# EAGLE design Modular-Sensor-Breakout-Board3 (EAGLE 5.12)

## Sheet 1 of 7
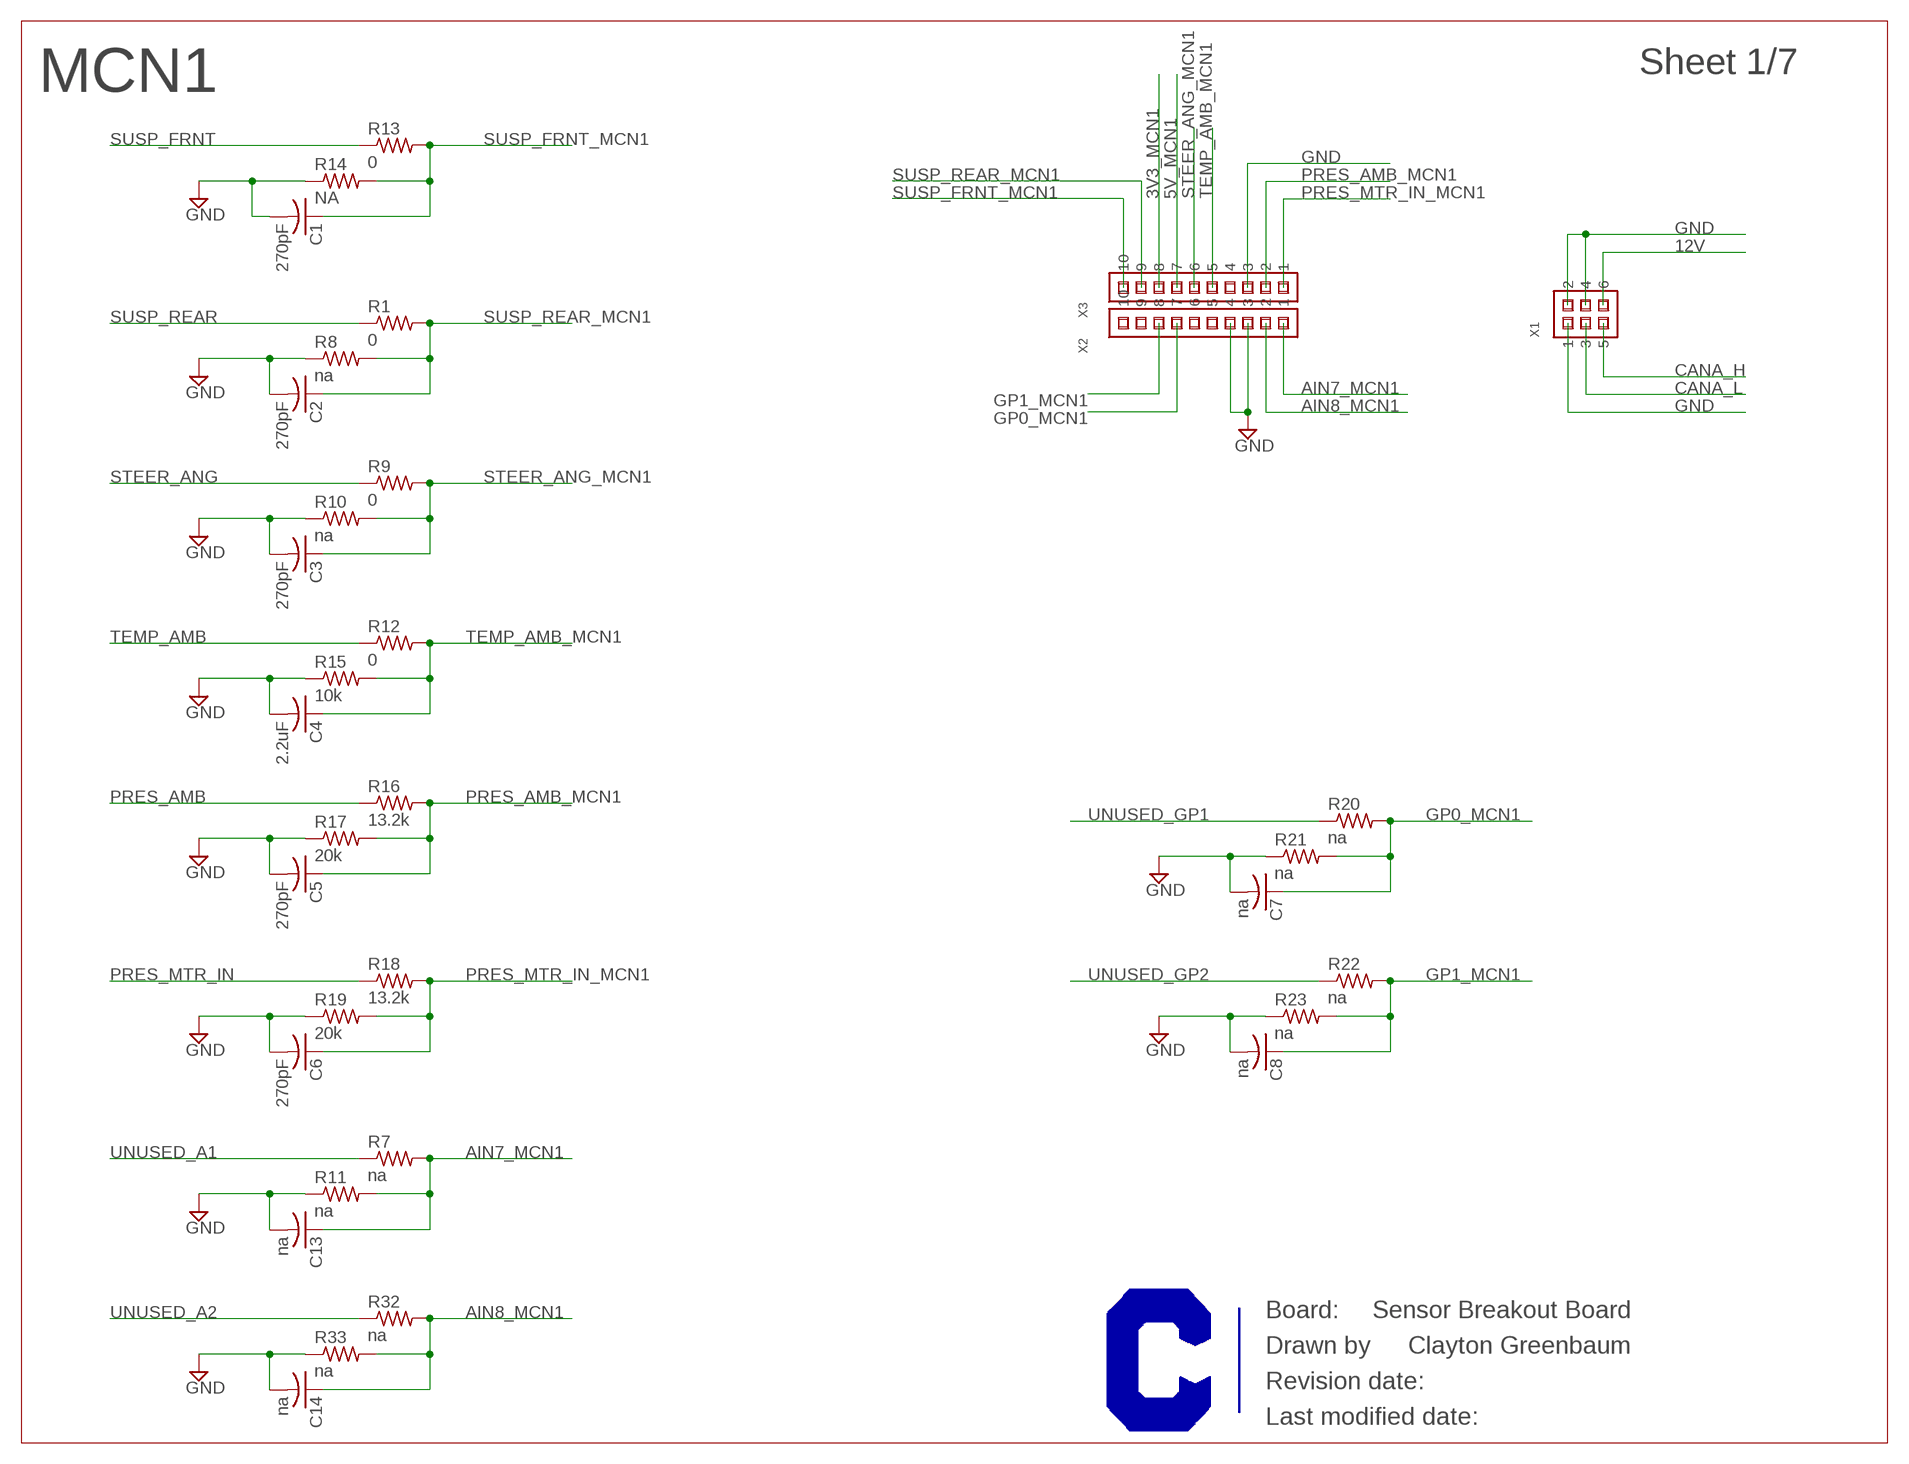
[diagram p0: schematic, sheet 1]

### Parts
C1  270pF  C-USC0603  [C0603]
C2  270pF  C-USC0603  [C0603]
C3  270pF  C-USC0603  [C0603]
C4  2.2uF  C-USC0603  [C0603]
C5  270pF  C-USC0603  [C0603]
C6  270pF  C-USC0603  [C0603]
C7  na  C-USC0603  [C0603]
C8  na  C-USC0603  [C0603]
C13  na  C-USC0603  [C0603]
C14  na  C-USC0603  [C0603]
R1  0  R-US_R0603  [R0603]
R7  na  R-US_R0603  [R0603]
R8  na  R-US_R0603  [R0603]
R9  0  R-US_R0603  [R0603]
R10  na  R-US_R0603  [R0603]
R11  na  R-US_R0603  [R0603]
R12  0  R-US_R0603  [R0603]
R13  0  R-US_R0603  [R0603]
R14  NA  R-US_R0603  [R0603]
R15  10k  R-US_R0603  [R0603]
R16  13.2k  R-US_R0603  [R0603]
R17  20k  R-US_R0603  [R0603]
R18  13.2k  R-US_R0603  [R0603]
R19  20k  R-US_R0603  [R0603]
R20  na  R-US_R0603  [R0603]
R21  na  R-US_R0603  [R0603]
R22  na  R-US_R0603  [R0603]
R23  na  R-US_R0603  [R0603]
R32  na  R-US_R0603  [R0603]
R33  na  R-US_R0603  [R0603]
X1  M22-71403XX  [M22-71403XX]
X2  M22-71310XX  [M22-71310XX]
X3  M22-71310XX  [M22-71310XX]

### Nets
3V3_MCN1: X3.8 ; also sheet 7
5V_MCN1: X3.7 ; also sheet 7
12V: X1.6 ; also sheet 2,3,4,5,6,7
AIN7_MCN1: C13.1 R7.2 R11.2 X2.1
AIN8_MCN1: C14.1 R32.2 R33.2 X2.2
CANA_H: X1.5 ; also sheet 2,3,5,6,7
CANA_L: X1.3 ; also sheet 2,3,5,6,7
GND: C1.2 C2.2 C3.2 C4.2 C5.2 C6.2 C7.2 C8.2 C13.2 C14.2 R8.1 R10.1 R11.1 R14.1 R15.1 R17.1 R19.1 R21.1 R23.1 R33.1 X1.1 X1.2 X1.4 X2.3 X2.4 X3.3 ; also sheet 2,3,4,5,6,7
GP0_MCN1: C7.1 R20.2 R21.2 X2.7
GP1_MCN1: C8.1 R22.2 R23.2 X2.8
PRES_AMB: R16.1 ; also sheet 7
PRES_AMB_MCN1: C5.1 R16.2 R17.2 X3.2
PRES_MTR_IN: R18.1 ; also sheet 7
PRES_MTR_IN_MCN1: C6.1 R18.2 R19.2 X3.1
STEER_ANG: R9.1 ; also sheet 7
STEER_ANG_MCN1: C3.1 R9.2 R10.2 X3.6
SUSP_FRNT: R13.1 ; also sheet 7
SUSP_FRNT_MCN1: C1.1 R13.2 R14.2 X3.10
SUSP_REAR: R1.1 ; also sheet 7
SUSP_REAR_MCN1: C2.1 R1.2 R8.2 X3.9
TEMP_AMB: R12.1 ; also sheet 7
TEMP_AMB_MCN1: C4.1 R12.2 R15.2 X3.5
UNUSED_A1: R7.1 ; also sheet 7
UNUSED_A2: R32.1 ; also sheet 7
UNUSED_GP1: R20.1 ; also sheet 7
UNUSED_GP2: R22.1 ; also sheet 7
Unconnected: X2.5 X2.6 X2.9 X2.10 X3.4

### Notes on the sheet
- MCN1
- Sensor Breakout Board
- Clayton Greenbaum

## Sheet 2 of 7
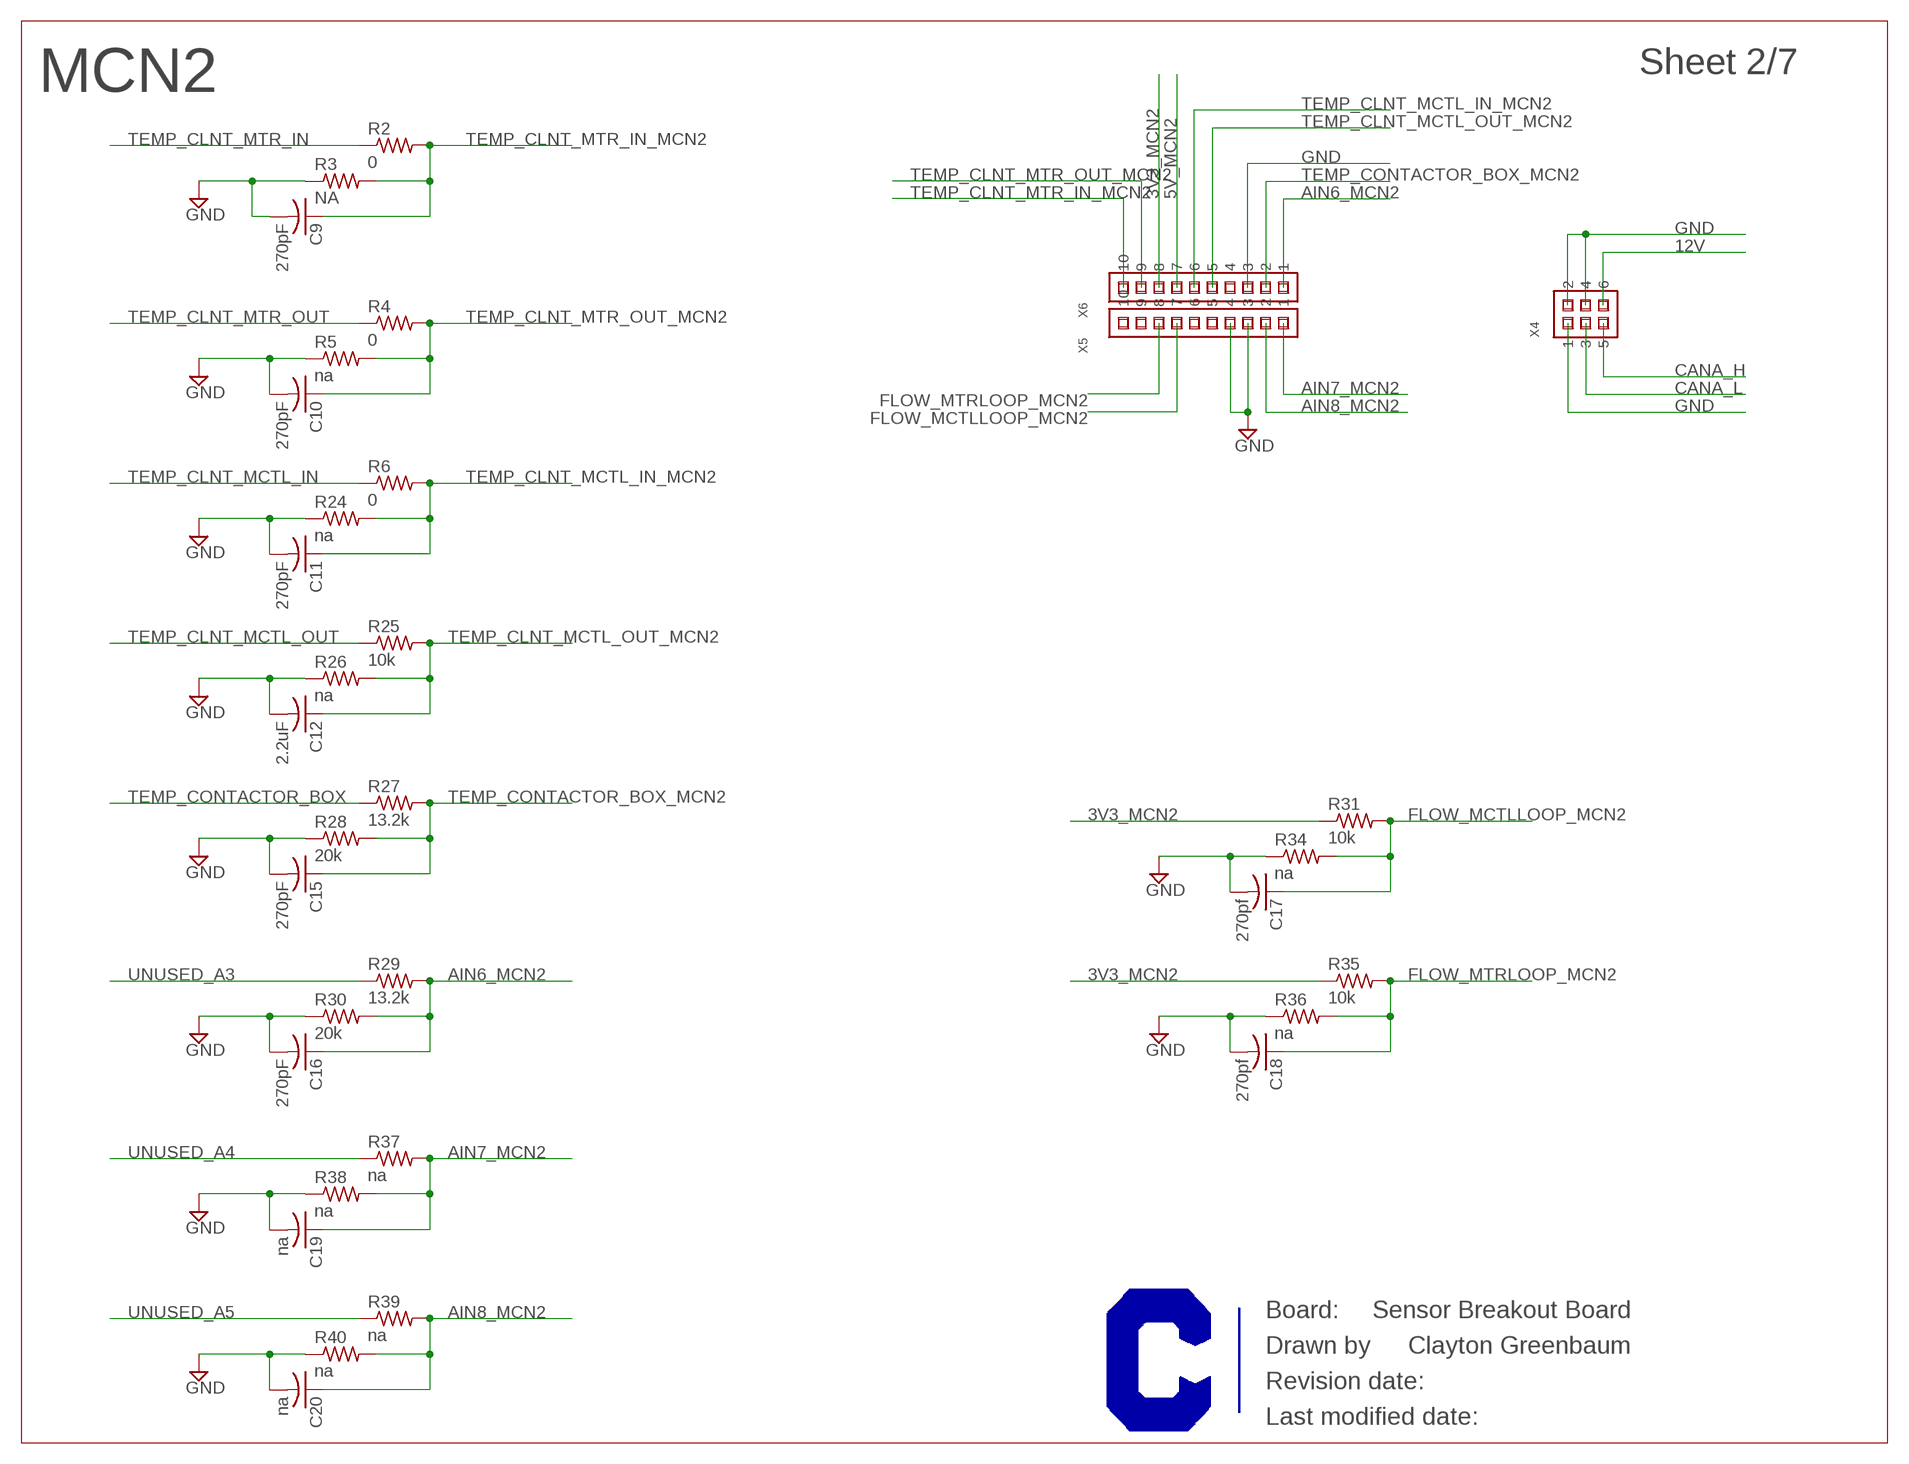
[diagram p1: schematic, sheet 2]

### Parts
C9  270pF  C-USC0603  [C0603]
C10  270pF  C-USC0603  [C0603]
C11  270pF  C-USC0603  [C0603]
C12  2.2uF  C-USC0603  [C0603]
C15  270pF  C-USC0603  [C0603]
C16  270pF  C-USC0603  [C0603]
C17  270pf  C-USC0603  [C0603]
C18  270pf  C-USC0603  [C0603]
C19  na  C-USC0603  [C0603]
C20  na  C-USC0603  [C0603]
R2  0  R-US_R0603  [R0603]
R3  NA  R-US_R0603  [R0603]
R4  0  R-US_R0603  [R0603]
R5  na  R-US_R0603  [R0603]
R6  0  R-US_R0603  [R0603]
R24  na  R-US_R0603  [R0603]
R25  10k  R-US_R0603  [R0603]
R26  na  R-US_R0603  [R0603]
R27  13.2k  R-US_R0603  [R0603]
R28  20k  R-US_R0603  [R0603]
R29  13.2k  R-US_R0603  [R0603]
R30  20k  R-US_R0603  [R0603]
R31  10k  R-US_R0603  [R0603]
R34  na  R-US_R0603  [R0603]
R35  10k  R-US_R0603  [R0603]
R36  na  R-US_R0603  [R0603]
R37  na  R-US_R0603  [R0603]
R38  na  R-US_R0603  [R0603]
R39  na  R-US_R0603  [R0603]
R40  na  R-US_R0603  [R0603]
X4  M22-71403XX  [M22-71403XX]
X5  M22-71310XX  [M22-71310XX]
X6  M22-71310XX  [M22-71310XX]

### Nets
3V3_MCN2: R31.1 R35.1 X6.8 ; also sheet 7
5V_MCN2: X6.7 ; also sheet 7
12V: X4.6 ; also sheet 1,3,4,5,6,7
AIN6_MCN2: C16.1 R29.2 R30.2 X6.1
AIN7_MCN2: C19.1 R37.2 R38.2 X5.1
AIN8_MCN2: C20.1 R39.2 R40.2 X5.2
CANA_H: X4.5 ; also sheet 1,3,5,6,7
CANA_L: X4.3 ; also sheet 1,3,5,6,7
FLOW_MCTLLOOP_MCN2: C17.1 R31.2 R34.2 X5.7 ; also sheet 7
FLOW_MTRLOOP_MCN2: C18.1 R35.2 R36.2 X5.8 ; also sheet 7
GND: C9.2 C10.2 C11.2 C12.2 C15.2 C16.2 C17.2 C18.2 C19.2 C20.2 R3.1 R5.1 R24.1 R26.1 R28.1 R30.1 R34.1 R36.1 R38.1 R40.1 X4.1 X4.2 X4.4 X5.3 X5.4 X6.3 ; also sheet 1,3,4,5,6,7
TEMP_CLNT_MCTL_IN: R6.1 ; also sheet 7
TEMP_CLNT_MCTL_IN_MCN2: C11.1 R6.2 R24.2 X6.6
TEMP_CLNT_MCTL_OUT: R25.1 ; also sheet 7
TEMP_CLNT_MCTL_OUT_MCN2: C12.1 R25.2 R26.2 X6.5
TEMP_CLNT_MTR_IN: R2.1 ; also sheet 7
TEMP_CLNT_MTR_IN_MCN2: C9.1 R2.2 R3.2 X6.10
TEMP_CLNT_MTR_OUT: R4.1 ; also sheet 7
TEMP_CLNT_MTR_OUT_MCN2: C10.1 R4.2 R5.2 X6.9
TEMP_CONTACTOR_BOX: R27.1 ; also sheet 7
TEMP_CONTACTOR_BOX_MCN2: C15.1 R27.2 R28.2 X6.2
UNUSED_A3: R29.1 ; also sheet 7
UNUSED_A4: R37.1 ; also sheet 7
UNUSED_A5: R39.1 ; also sheet 7
Unconnected: X5.5 X5.6 X5.9 X5.10 X6.4

### Notes on the sheet
- MCN2
- Sensor Breakout Board
- Clayton Greenbaum

## Sheet 3 of 7
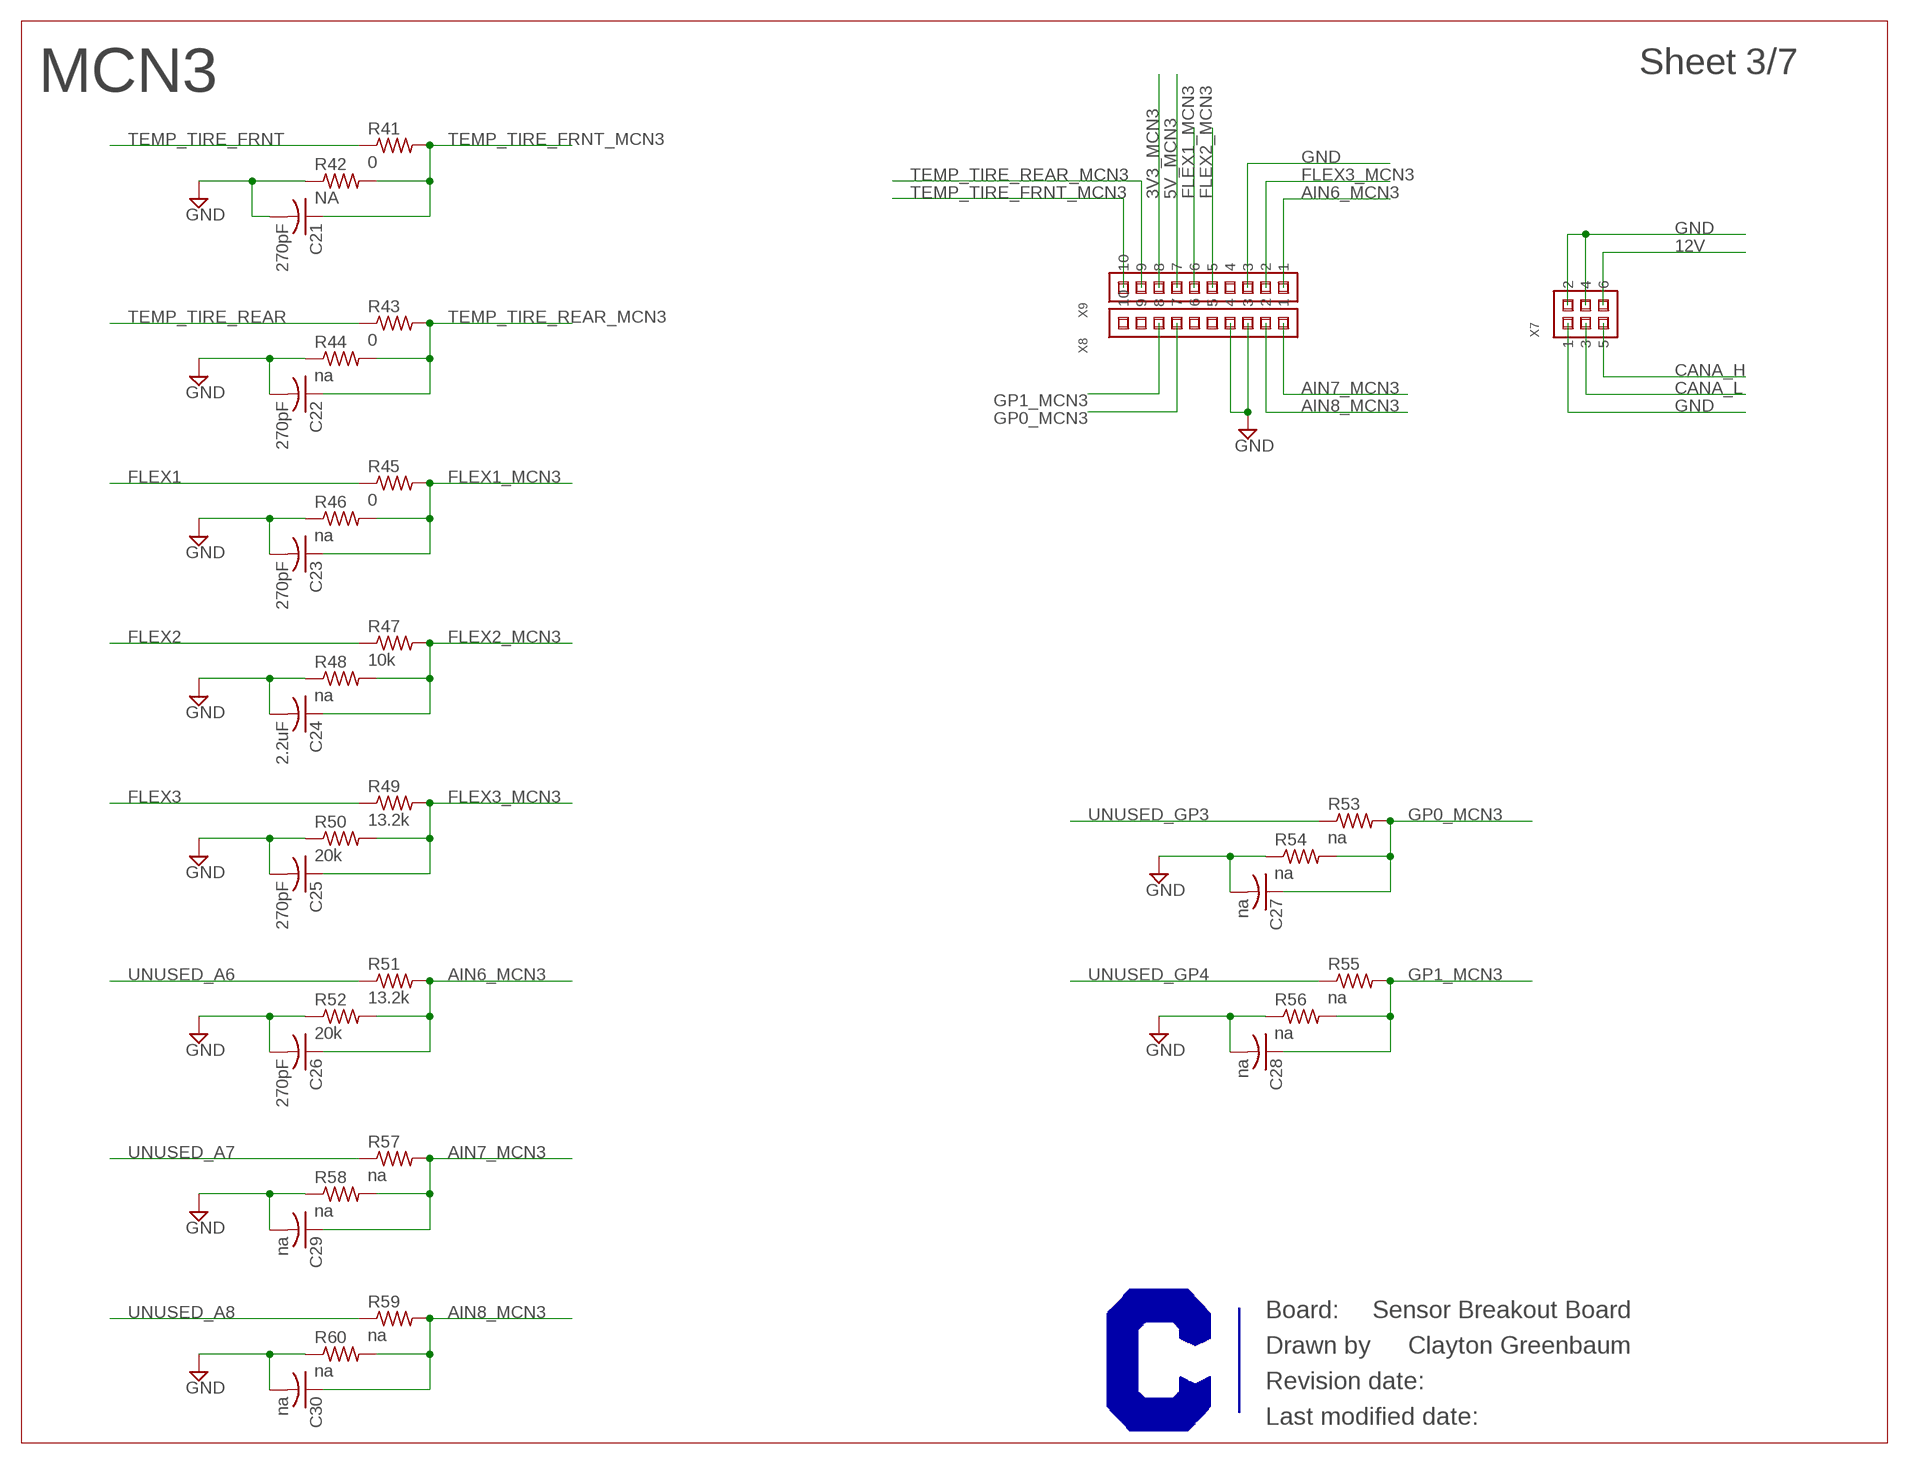
[diagram p2: schematic, sheet 3]

### Parts
C21  270pF  C-USC0603  [C0603]
C22  270pF  C-USC0603  [C0603]
C23  270pF  C-USC0603  [C0603]
C24  2.2uF  C-USC0603  [C0603]
C25  270pF  C-USC0603  [C0603]
C26  270pF  C-USC0603  [C0603]
C27  na  C-USC0603  [C0603]
C28  na  C-USC0603  [C0603]
C29  na  C-USC0603  [C0603]
C30  na  C-USC0603  [C0603]
R41  0  R-US_R0603  [R0603]
R42  NA  R-US_R0603  [R0603]
R43  0  R-US_R0603  [R0603]
R44  na  R-US_R0603  [R0603]
R45  0  R-US_R0603  [R0603]
R46  na  R-US_R0603  [R0603]
R47  10k  R-US_R0603  [R0603]
R48  na  R-US_R0603  [R0603]
R49  13.2k  R-US_R0603  [R0603]
R50  20k  R-US_R0603  [R0603]
R51  13.2k  R-US_R0603  [R0603]
R52  20k  R-US_R0603  [R0603]
R53  na  R-US_R0603  [R0603]
R54  na  R-US_R0603  [R0603]
R55  na  R-US_R0603  [R0603]
R56  na  R-US_R0603  [R0603]
R57  na  R-US_R0603  [R0603]
R58  na  R-US_R0603  [R0603]
R59  na  R-US_R0603  [R0603]
R60  na  R-US_R0603  [R0603]
X7  M22-71403XX  [M22-71403XX]
X8  M22-71310XX  [M22-71310XX]
X9  M22-71310XX  [M22-71310XX]

### Nets
3V3_MCN3: X9.8 ; also sheet 7
5V_MCN3: X9.7 ; also sheet 7
12V: X7.6 ; also sheet 1,2,4,5,6,7
AIN6_MCN3: C26.1 R51.2 R52.2 X9.1
AIN7_MCN3: C29.1 R57.2 R58.2 X8.1
AIN8_MCN3: C30.1 R59.2 R60.2 X8.2
CANA_H: X7.5 ; also sheet 1,2,5,6,7
CANA_L: X7.3 ; also sheet 1,2,5,6,7
FLEX1: R45.1 ; also sheet 7
FLEX1_MCN3: C23.1 R45.2 R46.2 X9.6
FLEX2: R47.1 ; also sheet 7
FLEX2_MCN3: C24.1 R47.2 R48.2 X9.5
FLEX3: R49.1 ; also sheet 7
FLEX3_MCN3: C25.1 R49.2 R50.2 X9.2
GND: C21.2 C22.2 C23.2 C24.2 C25.2 C26.2 C27.2 C28.2 C29.2 C30.2 R42.1 R44.1 R46.1 R48.1 R50.1 R52.1 R54.1 R56.1 R58.1 R60.1 X7.1 X7.2 X7.4 X8.3 X8.4 X9.3 ; also sheet 1,2,4,5,6,7
GP0_MCN3: C27.1 R53.2 R54.2 X8.7
GP1_MCN3: C28.1 R55.2 R56.2 X8.8
TEMP_TIRE_FRNT: R41.1 ; also sheet 7
TEMP_TIRE_FRNT_MCN3: C21.1 R41.2 R42.2 X9.10
TEMP_TIRE_REAR: R43.1 ; also sheet 7
TEMP_TIRE_REAR_MCN3: C22.1 R43.2 R44.2 X9.9
UNUSED_A6: R51.1 ; also sheet 7
UNUSED_A7: R57.1 ; also sheet 7
UNUSED_A8: R59.1 ; also sheet 7
UNUSED_GP3: R53.1 ; also sheet 7
UNUSED_GP4: R55.1 ; also sheet 7
Unconnected: X8.5 X8.6 X8.9 X8.10 X9.4

### Notes on the sheet
- MCN3
- Sensor Breakout Board
- Clayton Greenbaum

## Sheet 4 of 7
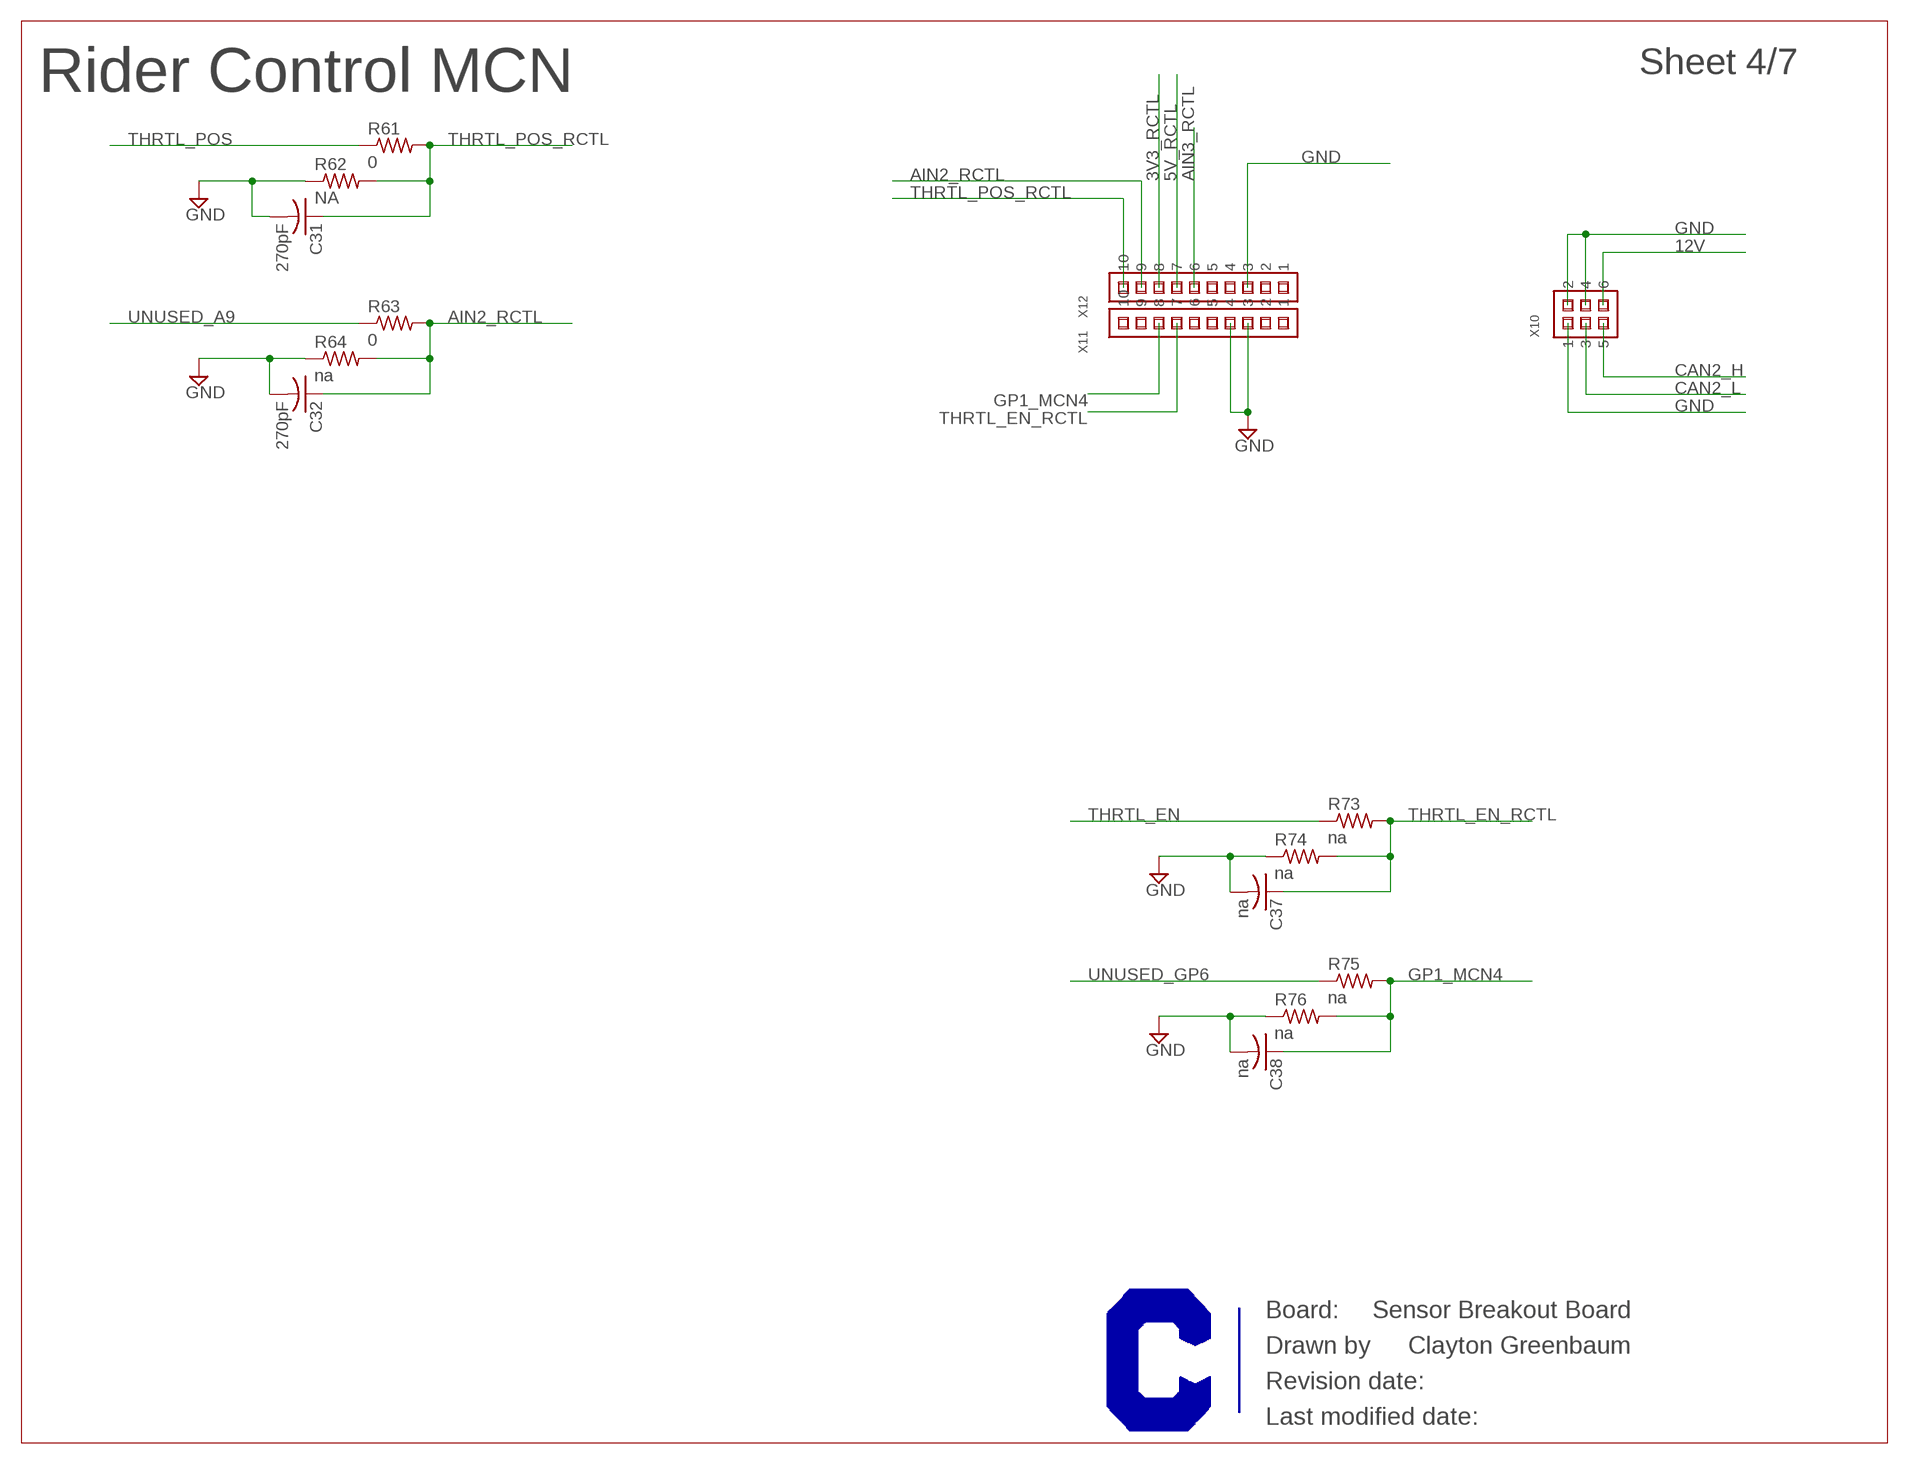
[diagram p3: schematic, sheet 4]

### Parts
C31  270pF  C-USC0603  [C0603]
C32  270pF  C-USC0603  [C0603]
C37  na  C-USC0603  [C0603]
C38  na  C-USC0603  [C0603]
R61  0  R-US_R0603  [R0603]
R62  NA  R-US_R0603  [R0603]
R63  0  R-US_R0603  [R0603]
R64  na  R-US_R0603  [R0603]
R73  na  R-US_R0603  [R0603]
R74  na  R-US_R0603  [R0603]
R75  na  R-US_R0603  [R0603]
R76  na  R-US_R0603  [R0603]
X10  M22-71403XX  [M22-71403XX]
X11  M22-71310XX  [M22-71310XX]
X12  M22-71310XX  [M22-71310XX]

### Nets
3V3_RCTL: X12.8 ; also sheet 7
5V_RCTL: X12.7 ; also sheet 7
12V: X10.6 ; also sheet 1,2,3,5,6,7
AIN2_RCTL: C32.1 R63.2 R64.2 X12.9
AIN3_RCTL: X12.6
CAN2_H: X10.5 ; also sheet 6,7
CAN2_L: X10.3 ; also sheet 6,7
GND: C31.2 C32.2 C37.2 C38.2 R62.1 R64.1 R74.1 R76.1 X10.1 X10.2 X10.4 X11.3 X11.4 X12.3 ; also sheet 1,2,3,5,6,7
GP1_MCN4: C38.1 R75.2 R76.2 X11.8
THRTL_EN: R73.1 ; also sheet 7
THRTL_EN_RCTL: C37.1 R73.2 R74.2 X11.7
THRTL_POS: R61.1 ; also sheet 7
THRTL_POS_RCTL: C31.1 R61.2 R62.2 X12.10
UNUSED_A9: R63.1 ; also sheet 7
UNUSED_GP6: R75.1 ; also sheet 7
Unconnected: X11.1 X11.2 X11.5 X11.6 X11.9 X11.10 X12.1 X12.2 X12.4 X12.5

### Notes on the sheet
- Rider Control MCN
- Sensor Breakout Board
- Clayton Greenbaum

## Sheet 5 of 7
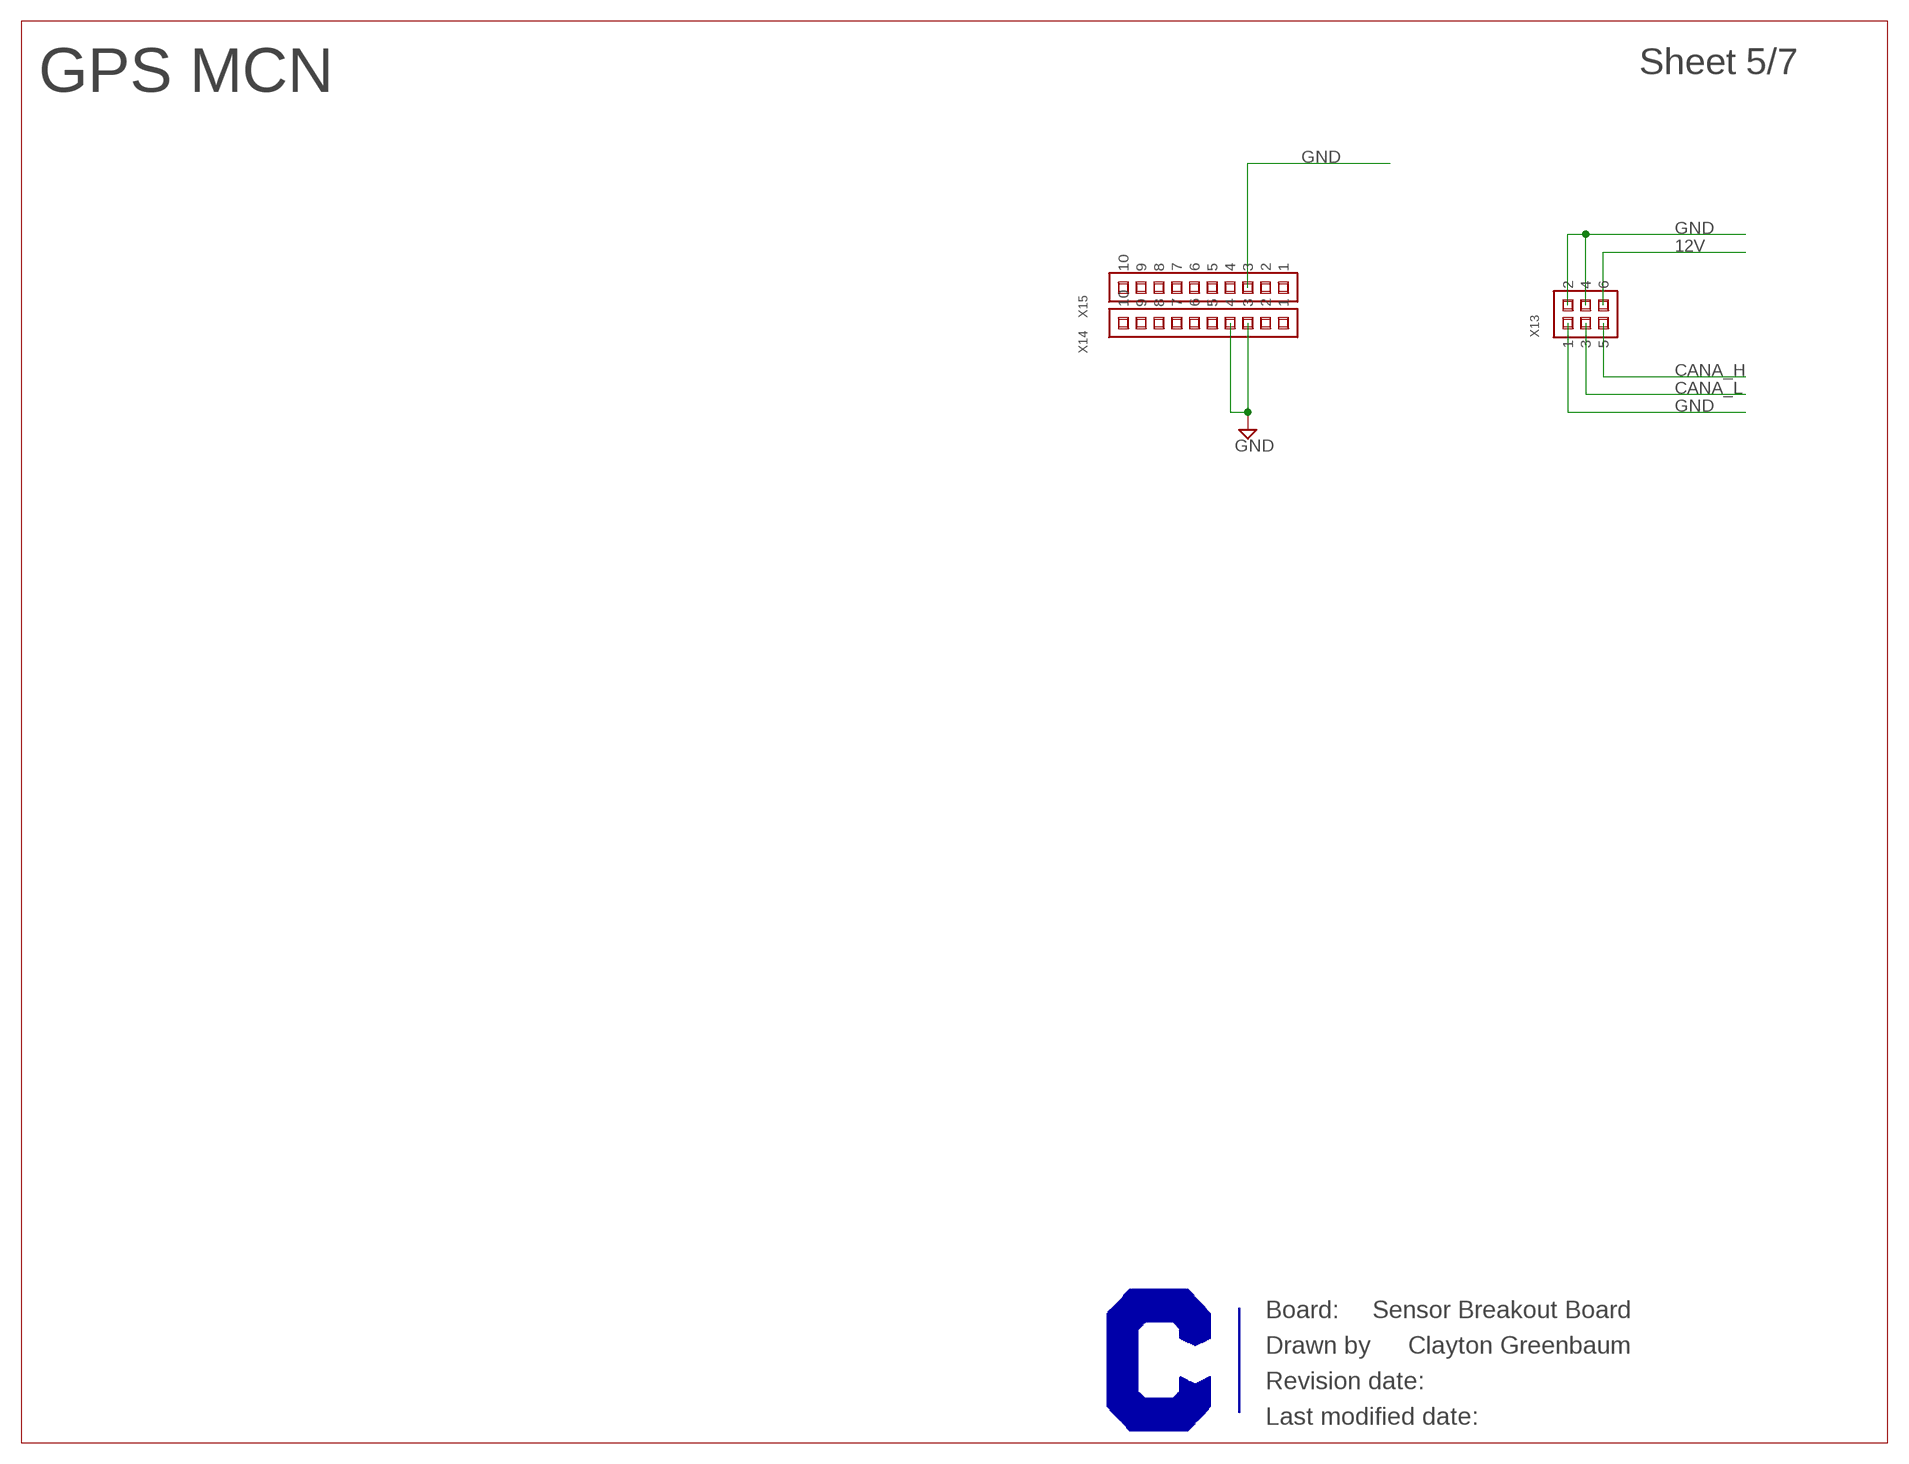
[diagram p4: schematic, sheet 5]

### Parts
X13  M22-71403XX  [M22-71403XX]
X14  M22-71310XX  [M22-71310XX]
X15  M22-71310XX  [M22-71310XX]

### Nets
12V: X13.6 ; also sheet 1,2,3,4,6,7
CANA_H: X13.5 ; also sheet 1,2,3,6,7
CANA_L: X13.3 ; also sheet 1,2,3,6,7
GND: X13.1 X13.2 X13.4 X14.3 X14.4 X15.3 ; also sheet 1,2,3,4,6,7
Unconnected: X14.1 X14.2 X14.5 X14.6 X14.7 X14.8 X14.9 X14.10 X15.1 X15.2 X15.4 X15.5 X15.6 X15.7 X15.8 X15.9 X15.10

### Notes on the sheet
- GPS MCN
- Sensor Breakout Board
- Clayton Greenbaum

## Sheet 6 of 7
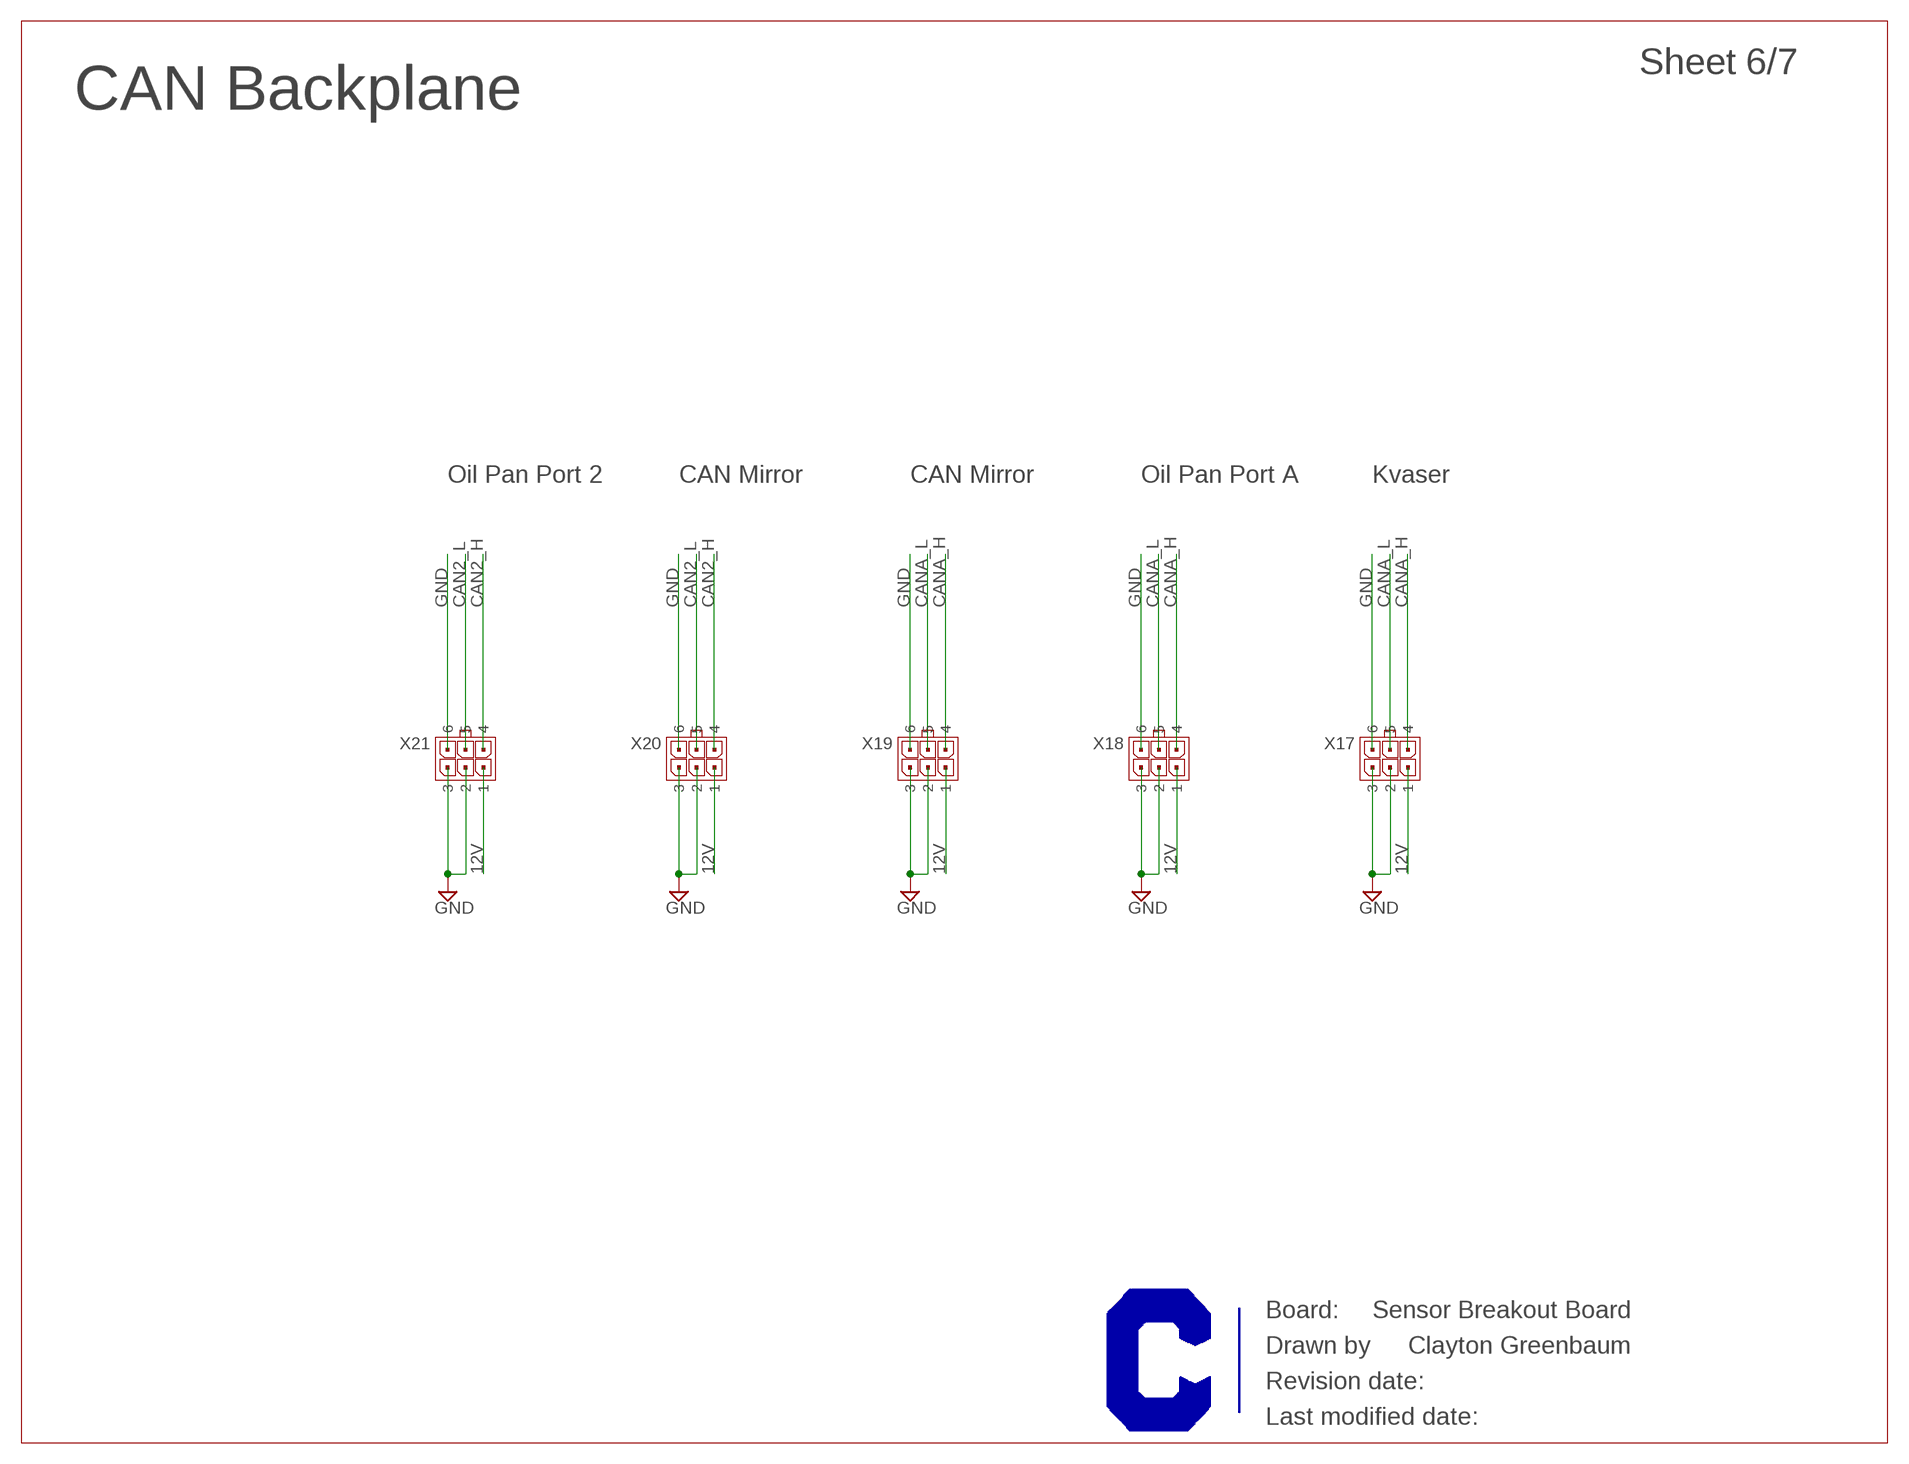
[diagram p5: schematic, sheet 6]

### Parts
X17  MICROFIT-06-DUAL-RA-SMD  [MICROFIT-6-DUAL-RA-SMD]
X18  MICROFIT-06-DUAL-RA-SMD  [MICROFIT-6-DUAL-RA-SMD]
X19  MICROFIT-06-DUAL-RA-SMD  [MICROFIT-6-DUAL-RA-SMD]
X20  MICROFIT-06-DUAL-RA-SMD  [MICROFIT-6-DUAL-RA-SMD]
X21  MICROFIT-06-DUAL-RA-SMD  [MICROFIT-6-DUAL-RA-SMD]

### Nets
12V: X17.1 X18.1 X19.1 X20.1 X21.1 ; also sheet 1,2,3,4,5,7
CAN2_H: X20.4 X21.4 ; also sheet 4,7
CAN2_L: X20.5 X21.5 ; also sheet 4,7
CANA_H: X17.4 X18.4 X19.4 ; also sheet 1,2,3,5,7
CANA_L: X17.5 X18.5 X19.5 ; also sheet 1,2,3,5,7
GND: X17.2 X17.3 X17.6 X18.2 X18.3 X18.6 X19.2 X19.3 X19.6 X20.2 X20.3 X20.6 X21.2 X21.3 X21.6 ; also sheet 1,2,3,4,5,7

### Notes on the sheet
- CAN Backplane
- Oil Pan Port 2 | CAN Mirror | CAN Mirror | Oil Pan Port A | Kvaser
- Sensor Breakout Board
- Clayton Greenbaum

## Sheet 7 of 7
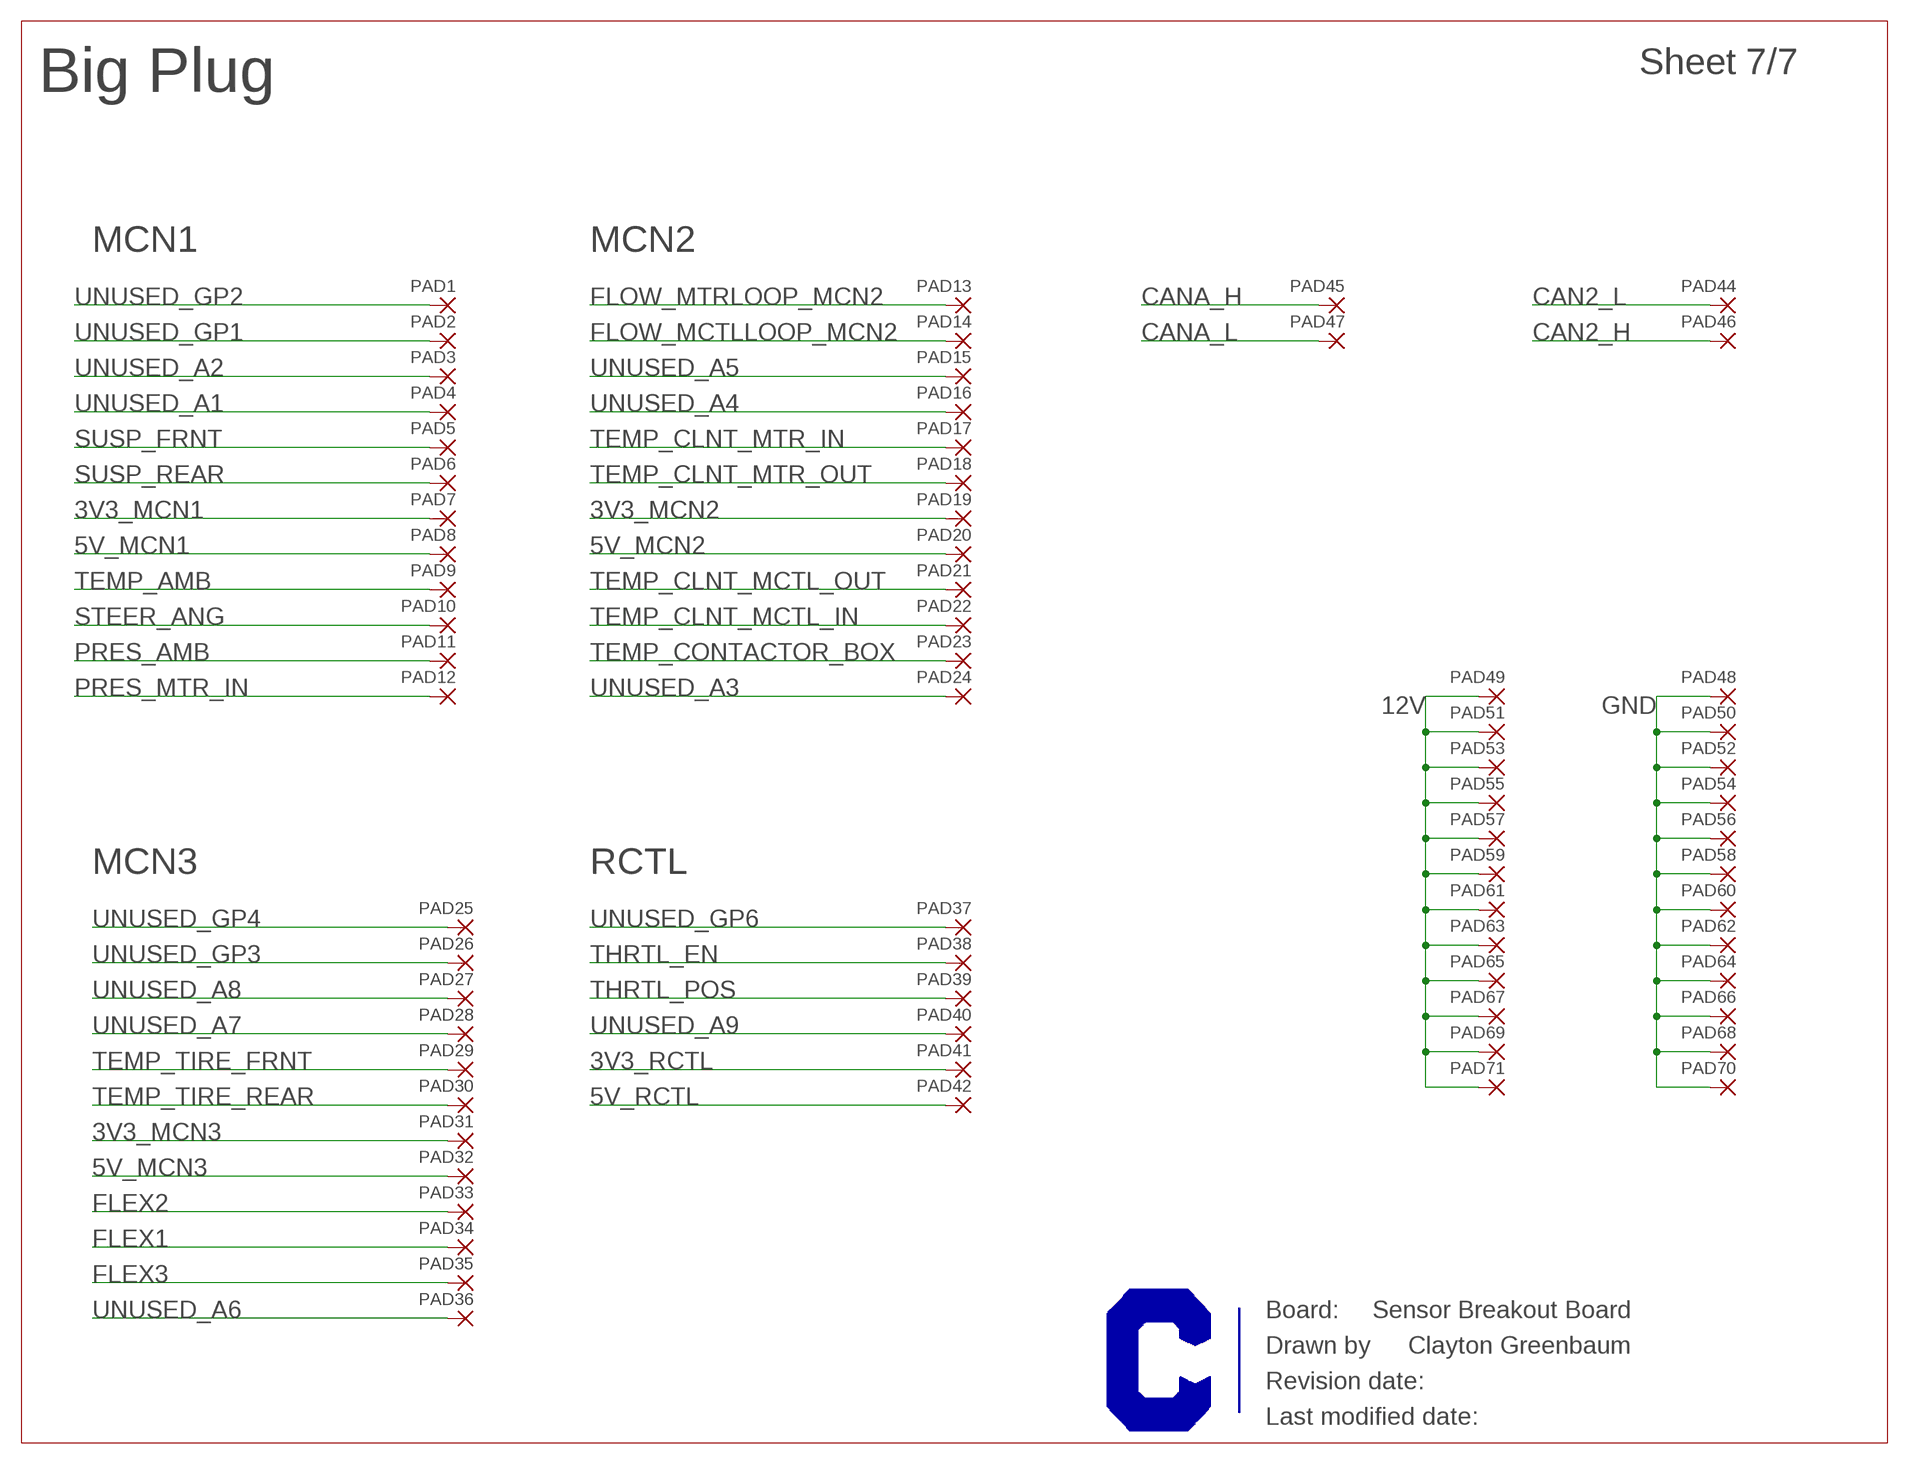
[diagram p6: schematic, sheet 7]

### Parts
PAD1  2,54/0,9  [2,54/0,9]
PAD2  2,54/0,9  [2,54/0,9]
PAD3  2,54/0,9  [2,54/0,9]
PAD4  2,54/0,9  [2,54/0,9]
PAD5  2,54/0,9  [2,54/0,9]
PAD6  2,54/0,9  [2,54/0,9]
PAD7  2,54/0,9  [2,54/0,9]
PAD8  2,54/0,9  [2,54/0,9]
PAD9  2,54/0,9  [2,54/0,9]
PAD10  2,54/0,9  [2,54/0,9]
PAD11  2,54/0,9  [2,54/0,9]
PAD12  2,54/0,9  [2,54/0,9]
PAD13  2,54/0,9  [2,54/0,9]
PAD14  2,54/0,9  [2,54/0,9]
PAD15  2,54/0,9  [2,54/0,9]
PAD16  2,54/0,9  [2,54/0,9]
PAD17  2,54/0,9  [2,54/0,9]
PAD18  2,54/0,9  [2,54/0,9]
PAD19  2,54/0,9  [2,54/0,9]
PAD20  2,54/0,9  [2,54/0,9]
PAD21  2,54/0,9  [2,54/0,9]
PAD22  2,54/0,9  [2,54/0,9]
PAD23  2,54/0,9  [2,54/0,9]
PAD24  2,54/0,9  [2,54/0,9]
PAD25  2,54/0,9  [2,54/0,9]
PAD26  2,54/0,9  [2,54/0,9]
PAD27  2,54/0,9  [2,54/0,9]
PAD28  2,54/0,9  [2,54/0,9]
PAD29  2,54/0,9  [2,54/0,9]
PAD30  2,54/0,9  [2,54/0,9]
PAD31  2,54/0,9  [2,54/0,9]
PAD32  2,54/0,9  [2,54/0,9]
PAD33  2,54/0,9  [2,54/0,9]
PAD34  2,54/0,9  [2,54/0,9]
PAD35  2,54/0,9  [2,54/0,9]
PAD36  2,54/0,9  [2,54/0,9]
PAD37  2,54/0,9  [2,54/0,9]
PAD38  2,54/0,9  [2,54/0,9]
PAD39  2,54/0,9  [2,54/0,9]
PAD40  2,54/0,9  [2,54/0,9]
PAD41  2,54/0,9  [2,54/0,9]
PAD42  2,54/0,9  [2,54/0,9]
PAD44  2,54/0,9  [2,54/0,9]
PAD45  2,54/0,9  [2,54/0,9]
PAD46  2,54/0,9  [2,54/0,9]
PAD47  2,54/0,9  [2,54/0,9]
PAD48  2,54/0,9  [2,54/0,9]
PAD49  2,54/0,9  [2,54/0,9]
PAD50  2,54/0,9  [2,54/0,9]
PAD51  2,54/0,9  [2,54/0,9]
PAD52  2,54/0,9  [2,54/0,9]
PAD53  2,54/0,9  [2,54/0,9]
PAD54  2,54/0,9  [2,54/0,9]
PAD55  2,54/0,9  [2,54/0,9]
PAD56  2,54/0,9  [2,54/0,9]
PAD57  2,54/0,9  [2,54/0,9]
PAD58  2,54/0,9  [2,54/0,9]
PAD59  2,54/0,9  [2,54/0,9]
PAD60  2,54/0,9  [2,54/0,9]
PAD61  2,54/0,9  [2,54/0,9]
PAD62  2,54/0,9  [2,54/0,9]
PAD63  2,54/0,9  [2,54/0,9]
PAD64  2,54/0,9  [2,54/0,9]
PAD65  2,54/0,9  [2,54/0,9]
PAD66  2,54/0,9  [2,54/0,9]
PAD67  2,54/0,9  [2,54/0,9]
PAD68  2,54/0,9  [2,54/0,9]
PAD69  2,54/0,9  [2,54/0,9]
PAD70  2,54/0,9  [2,54/0,9]
PAD71  2,54/0,9  [2,54/0,9]

### Nets
3V3_MCN1: PAD7.1(P) ; also sheet 1
3V3_MCN2: PAD19.1(P) ; also sheet 2
3V3_MCN3: PAD31.1(P) ; also sheet 3
3V3_RCTL: PAD41.1(P) ; also sheet 4
5V_MCN1: PAD8.1(P) ; also sheet 1
5V_MCN2: PAD20.1(P) ; also sheet 2
5V_MCN3: PAD32.1(P) ; also sheet 3
5V_RCTL: PAD42.1(P) ; also sheet 4
12V: PAD49.1(P) PAD51.1(P) PAD53.1(P) PAD55.1(P) PAD57.1(P) PAD59.1(P) PAD61.1(P) PAD63.1(P) PAD65.1(P) PAD67.1(P) PAD69.1(P) PAD71.1(P) ; also sheet 1,2,3,4,5,6
CAN2_H: PAD46.1(P) ; also sheet 4,6
CAN2_L: PAD44.1(P) ; also sheet 4,6
CANA_H: PAD45.1(P) ; also sheet 1,2,3,5,6
CANA_L: PAD47.1(P) ; also sheet 1,2,3,5,6
FLEX1: PAD34.1(P) ; also sheet 3
FLEX2: PAD33.1(P) ; also sheet 3
FLEX3: PAD35.1(P) ; also sheet 3
FLOW_MCTLLOOP_MCN2: PAD14.1(P) ; also sheet 2
FLOW_MTRLOOP_MCN2: PAD13.1(P) ; also sheet 2
GND: PAD48.1(P) PAD50.1(P) PAD52.1(P) PAD54.1(P) PAD56.1(P) PAD58.1(P) PAD60.1(P) PAD62.1(P) PAD64.1(P) PAD66.1(P) PAD68.1(P) PAD70.1(P) ; also sheet 1,2,3,4,5,6
PRES_AMB: PAD11.1(P) ; also sheet 1
PRES_MTR_IN: PAD12.1(P) ; also sheet 1
STEER_ANG: PAD10.1(P) ; also sheet 1
SUSP_FRNT: PAD5.1(P) ; also sheet 1
SUSP_REAR: PAD6.1(P) ; also sheet 1
TEMP_AMB: PAD9.1(P) ; also sheet 1
TEMP_CLNT_MCTL_IN: PAD22.1(P) ; also sheet 2
TEMP_CLNT_MCTL_OUT: PAD21.1(P) ; also sheet 2
TEMP_CLNT_MTR_IN: PAD17.1(P) ; also sheet 2
TEMP_CLNT_MTR_OUT: PAD18.1(P) ; also sheet 2
TEMP_CONTACTOR_BOX: PAD23.1(P) ; also sheet 2
TEMP_TIRE_FRNT: PAD29.1(P) ; also sheet 3
TEMP_TIRE_REAR: PAD30.1(P) ; also sheet 3
THRTL_EN: PAD38.1(P) ; also sheet 4
THRTL_POS: PAD39.1(P) ; also sheet 4
UNUSED_A1: PAD4.1(P) ; also sheet 1
UNUSED_A2: PAD3.1(P) ; also sheet 1
UNUSED_A3: PAD24.1(P) ; also sheet 2
UNUSED_A4: PAD16.1(P) ; also sheet 2
UNUSED_A5: PAD15.1(P) ; also sheet 2
UNUSED_A6: PAD36.1(P) ; also sheet 3
UNUSED_A7: PAD28.1(P) ; also sheet 3
UNUSED_A8: PAD27.1(P) ; also sheet 3
UNUSED_A9: PAD40.1(P) ; also sheet 4
UNUSED_GP1: PAD2.1(P) ; also sheet 1
UNUSED_GP2: PAD1.1(P) ; also sheet 1
UNUSED_GP3: PAD26.1(P) ; also sheet 3
UNUSED_GP4: PAD25.1(P) ; also sheet 3
UNUSED_GP6: PAD37.1(P) ; also sheet 4

### Notes on the sheet
- Big Plug
- MCN1 | MCN2
- MCN3 | RCTL
- Sensor Breakout Board
- Clayton Greenbaum

## Library data of the parts
C1-C32 C37 C38 = resistor:C-US: CAPACITOR, American symbol
PAD1-PAD42 PAD44-PAD71 = wirepad:2,54/0,9: THROUGH-HOLE PAD
R1-R64 R73-R76 = rcl:R-US_: RESISTOR, American symbol
X1 X4 X7 X10 X13 = Harwin:M22-71403XX: M22-71403XX - 2x3 pos female header assy, 2.0mm pitch Datasheet: https://cdn.harwin.com/pdfs/M22-714.pdf; PARTNO: M22-7140342
X2 X3 X5 X6 X8 X9 X11 X12 X14 X15 = Harwin:M22-71310XX: Harwin M22-71310XX - 10pos single row female pin hdr, 2mm pitch Datasheet: https://cdn.harwin.com/pdfs/M22-713.pdf; PARTNO: M22-7131042
X17-X21 = Molex:MICROFIT-06-DUAL: Molex MicroFit 3.00mm Pitch Header, Surface Mount, Dual Row, 6 Circuits Note, November 2014: These come in three styles: Through-hole, with metal clip retention to PCB (not currently represented) (cheapest) SMD, with solder tab retention (-SMD) (more expensive, commonly stocked) SMD, with metal clip retention (-SMD-CLIP_RETENTION) (most expensive, not often stocked) Please use them in that order! Drawing: http://www.molex.com/pdm_docs/sd/430450609_sd.pdf (right-angle) Information: http://www.molex.com/molex/products/datasheet.jsp?part=active/0430450618_PCB_HEADERS.xml; PARTNO: 43045-0609

## Board
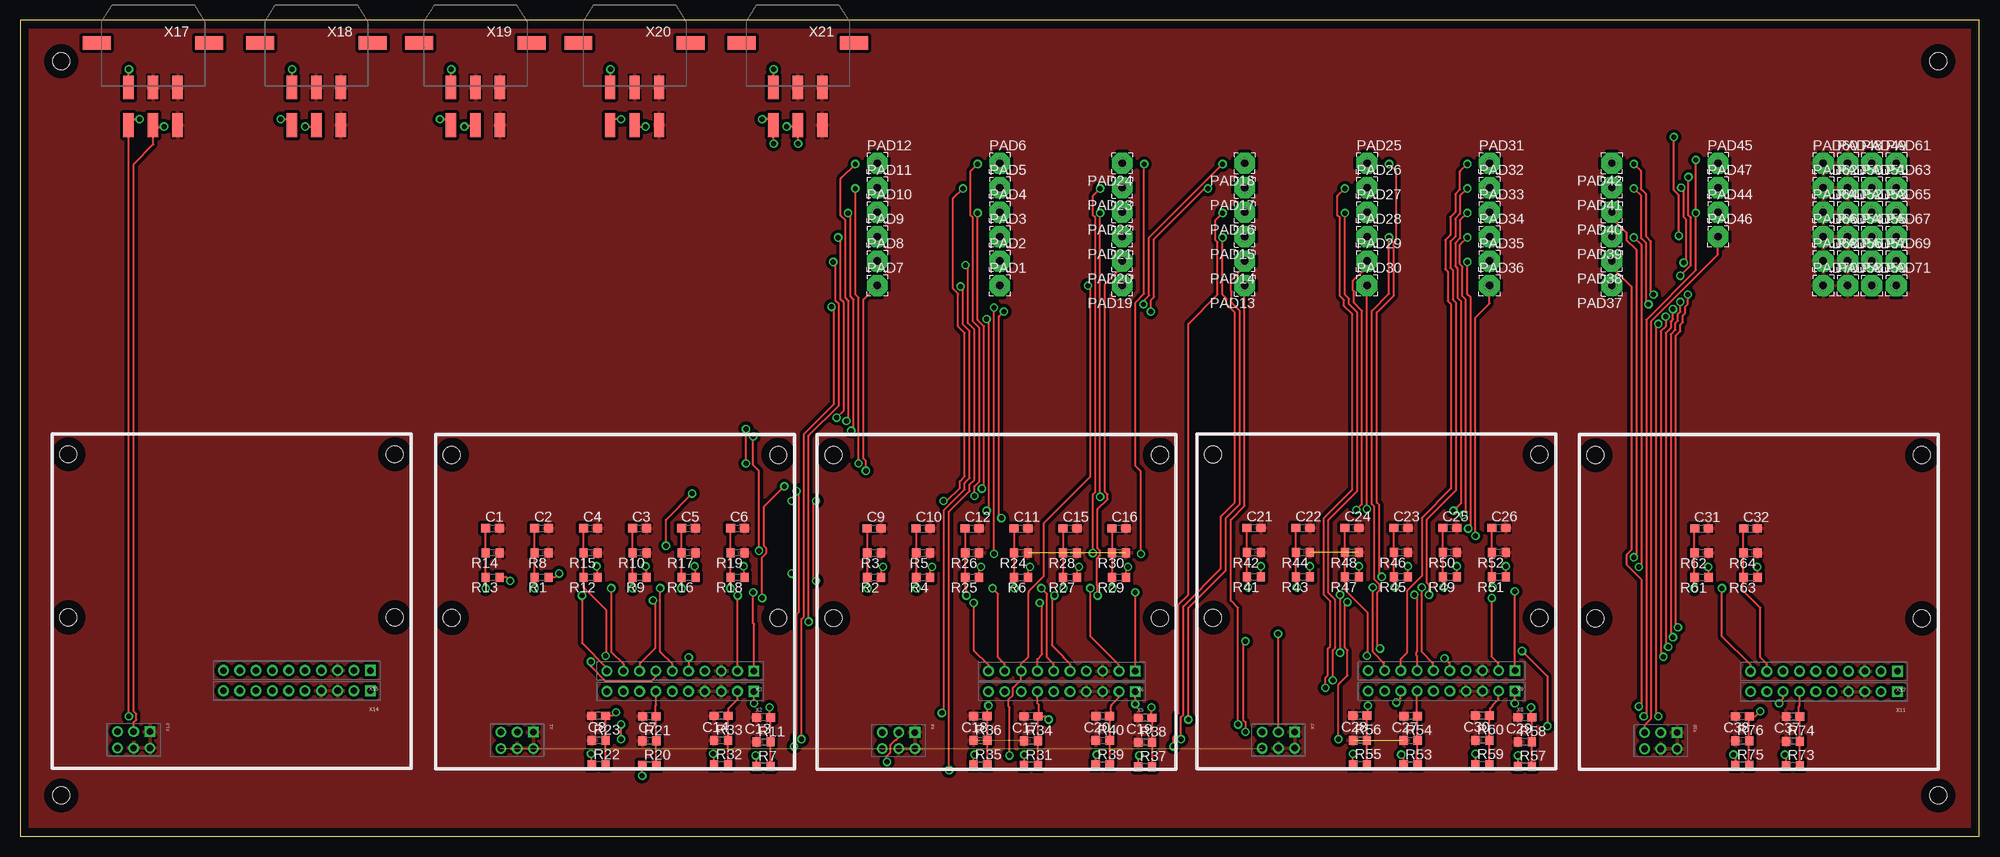
[diagram p7: board, top side]
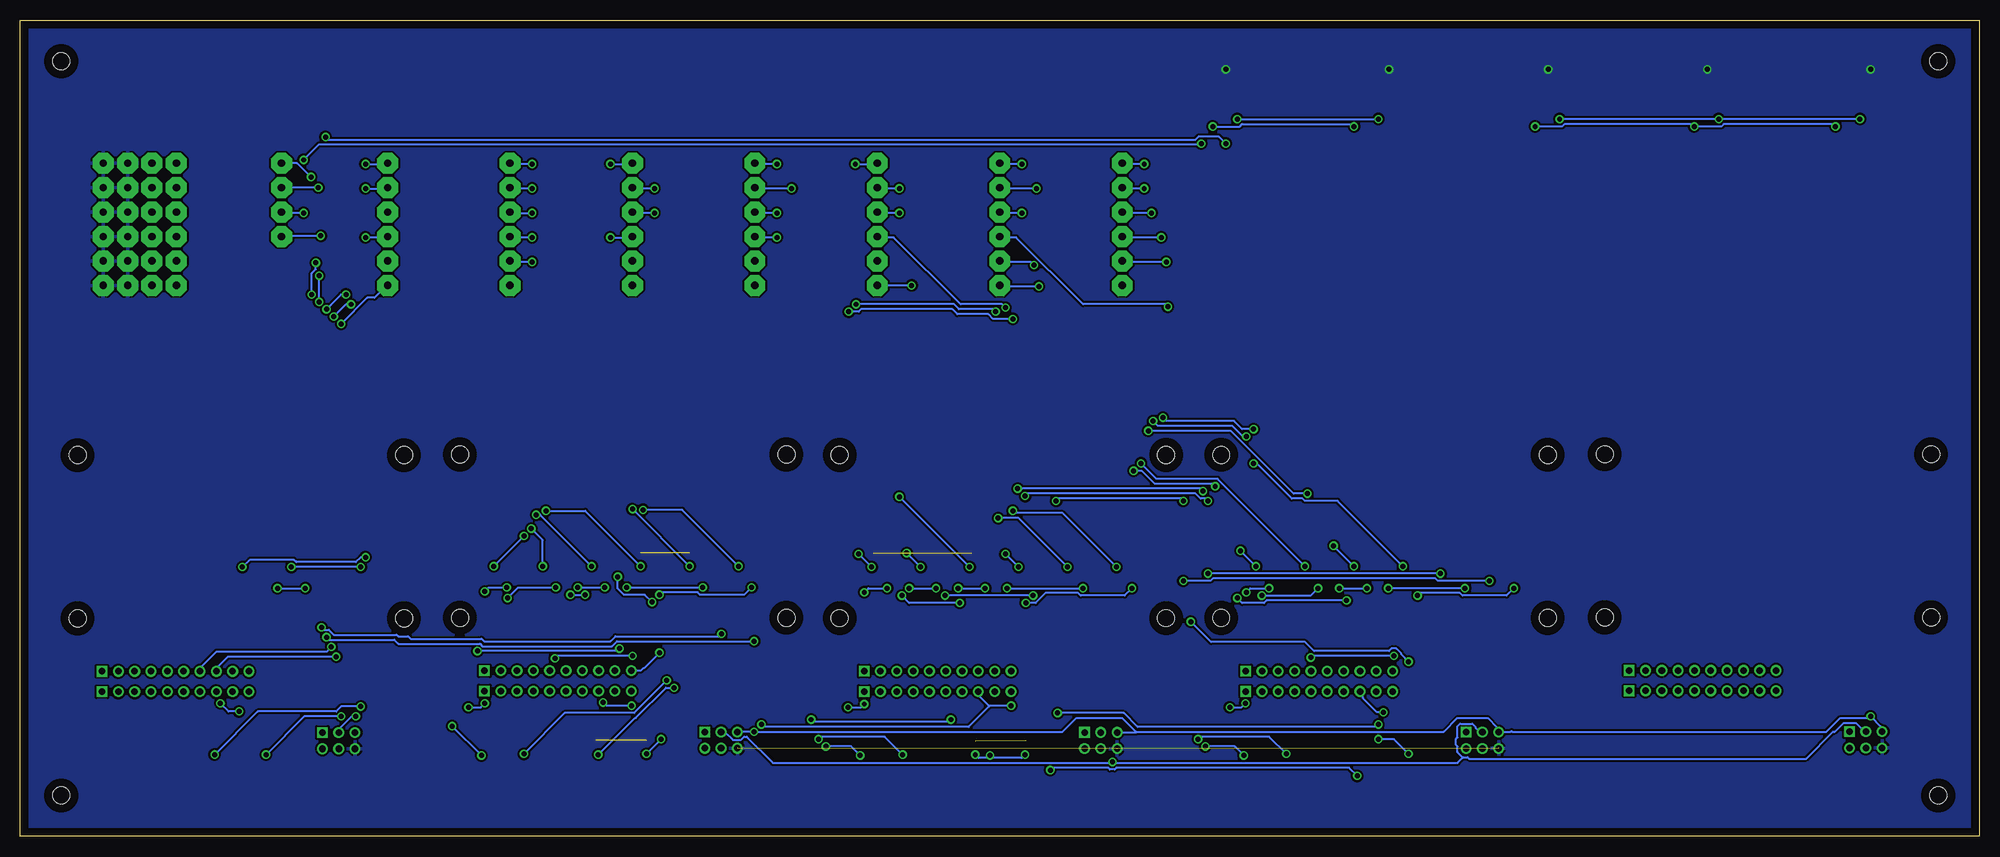
[diagram p8: board, bottom side, seen from below]

Size 240 x 100 mm. Coordinates in mm from the lower left corner, seen from the top.
Outline: 0,0 240,0 240,100 0,100 0,0
Copper layers (1*16): Top 0.035mm / dielectric 1.5mm / Bottom 0.035mm
Design rules "default *": minimum track width 10mil, minimum drill 24mil, track to track 10mil, track to pad 8mil, pad to pad 8mil, via to via 8mil, smd to smd 8mil, copper to edge 40mil, drill to drill 8mil, minimum pad ring 10mil, minimum via ring 8mil, stop-mask expansion 4mil, vias tented up to drill 0mil, thermal gap 10mil
Holes 2.1 mm at 92.86,26.75 92.86,46.76 52.87,46.76 52.87,26.75 139.62,26.73 139.62,46.73 99.61,46.73 99.61,26.73 186.15,26.79 186.15,46.78 146.15,46.78 146.15,26.79 233,26.71 233,46.72 193,46.72 193,26.71 45.88,26.82 45.88,46.83 5.88,46.83 5.88,26.82 5,95 5,5 235,5 235,95

### Footprints (pad centres in the part's own frame; a part is rotated, then mirrored left to right if it is on the bottom)
C0603 = smd 1.1 x 1: 1 -0.85,0; 2 0.85,0
2,54/0,9 = drill 0.914 pad 2.54 octagon: 1 0,0
R0603 = smd 1 x 1.1: 1 -0.85,0; 2 0.85,0
M22-71403XX = drill 0.8 square: 1 -1,2 | drill 0.8 round: 2 1,2; 3 -1,0; 4 1,0; 5 -1,-2; 6 1,-2
M22-71310XX = drill 0.8 square: 1 0,-9 | drill 0.8 round: 2 0,-7; 3 0,-5; 4 0,-3; 5 0,-1; 6 0,1; 7 0,3; 8 0,5; 9 0,7; 10 0,9
MICROFIT-6-DUAL-RA-SMD = smd 1.27 x 2.921: 1 3,5.47; 2 0,5.47; 3 -3,5.47; 4 3,10.1; 5 0,10.1; 6 -3,10.1 | smd 3.429 x 1.651: P$9 6.883,0; P$10 -6.883,0

### Placement (x,y rotation side)
C1  57.87,37.76 0 top
C2  63.87,37.76 0 top
C3  75.86,37.76 0 top
C4  69.86,37.76 0 top
C5  81.86,37.76 0 top
C6  87.86,37.76 0 top
C7  77.06,14.71 180 top
C8  70.86,14.76 180 top
C9  104.61,37.73 0 top
C10  110.61,37.73 0 top
C11  122.61,37.73 0 top
C12  116.61,37.73 0 top
C13  91.06,14.55 180 top
C14  85.86,14.76 180 top
C15  128.62,37.73 0 top
C16  134.62,37.73 0 top
C17  123.81,14.69 180 top
C18  117.61,14.73 180 top
C19  137.81,14.54 180 top
C20  132.62,14.73 180 top
C21  151.15,37.78 0 top
C22  157.15,37.78 0 top
C23  169.15,37.78 0 top
C24  163.15,37.78 0 top
C25  175.15,37.78 0 top
C26  181.15,37.78 0 top
C27  170.34,14.73 180 top
C28  164.15,14.79 180 top
C29  184.34,14.59 180 top
C30  179.15,14.79 180 top
C31  206,37.72 0 top
C32  212,37.72 0 top
C37  217.19,14.66 180 top
C38  211,14.71 180 top
PAD1  120,67.5 0 top
PAD2  120,70.5 0 top
PAD3  120,73.5 0 top
PAD4  120,76.5 0 top
PAD5  120,79.5 0 top
PAD6  120,82.5 0 top
PAD7  105,67.5 0 top
PAD8  105,70.5 0 top
PAD9  105,73.5 0 top
PAD10  105,76.5 0 top
PAD11  105,79.5 0 top
PAD12  105,82.5 0 top
PAD13  150,67.5 180 top
PAD14  150,70.5 180 top
PAD15  150,73.5 180 top
PAD16  150,76.5 180 top
PAD17  150,79.5 180 top
PAD18  150,82.5 180 top
PAD19  135,67.5 180 top
PAD20  135,70.5 180 top
PAD21  135,73.5 180 top
PAD22  135,76.5 180 top
PAD23  135,79.5 180 top
PAD24  135,82.5 180 top
PAD25  165,82.5 0 top
PAD26  165,79.5 0 top
PAD27  165,76.5 0 top
PAD28  165,73.5 0 top
PAD29  165,70.5 0 top
PAD30  165,67.5 0 top
PAD31  180,82.5 0 top
PAD32  180,79.5 0 top
PAD33  180,76.5 0 top
PAD34  180,73.5 0 top
PAD35  180,70.5 0 top
PAD36  180,67.5 0 top
PAD37  195,67.5 180 top
PAD38  195,70.5 180 top
PAD39  195,73.5 180 top
PAD40  195,76.5 180 top
PAD41  195,79.5 180 top
PAD42  195,82.5 180 top
PAD44  208,76.5 0 top
PAD45  208,82.5 0 top
PAD46  208,73.5 0 top
PAD47  208,79.5 0 top
PAD48  223.9,82.5 0 top
PAD49  226.85,82.5 0 top
PAD50  223.9,79.5 0 top
PAD51  226.85,79.5 0 top
PAD52  223.9,76.5 0 top
PAD53  226.85,76.5 0 top
PAD54  223.9,73.5 0 top
PAD55  226.85,73.5 0 top
PAD56  223.9,70.5 0 top
PAD57  226.85,70.5 0 top
PAD58  223.9,67.5 0 top
PAD59  226.85,67.5 0 top
PAD60  220.9,82.5 0 top
PAD61  229.85,82.5 0 top
PAD62  220.9,79.5 0 top
PAD63  229.85,79.5 0 top
PAD64  220.9,76.5 0 top
PAD65  229.85,76.5 0 top
PAD66  220.9,73.5 0 top
PAD67  229.85,73.5 0 top
PAD68  220.9,70.5 0 top
PAD69  229.85,70.5 0 top
PAD70  220.9,67.5 0 top
PAD71  229.85,67.5 0 top
R1  63.87,31.75 180 top
R2  104.61,31.73 180 top
R3  104.61,34.73 180 top
R4  110.61,31.73 180 top
R5  110.61,34.73 180 top
R6  122.61,31.73 180 top
R7  91.06,8.55 0 top
R8  63.87,34.76 180 top
R9  75.86,31.75 180 top
R10  75.86,34.76 180 top
R11  91.06,11.55 0 top
R12  69.86,31.75 180 top
R13  57.87,31.75 180 top
R14  57.87,34.76 180 top
R15  69.86,34.76 180 top
R16  81.86,31.75 180 top
R17  81.86,34.76 180 top
R18  87.86,31.75 180 top
R19  87.86,34.76 180 top
R20  77.06,8.71 0 top
R21  77.06,11.71 0 top
R22  70.86,8.76 0 top
R23  70.86,11.76 0 top
R24  122.61,34.73 180 top
R25  116.61,31.73 180 top
R26  116.61,34.73 180 top
R27  128.62,31.73 180 top
R28  128.62,34.73 180 top
R29  134.62,31.73 180 top
R30  134.62,34.73 180 top
R31  123.81,8.69 0 top
R32  85.86,8.76 0 top
R33  85.86,11.76 0 top
R34  123.81,11.69 0 top
R35  117.61,8.73 0 top
R36  117.61,11.73 0 top
R37  137.81,8.54 0 top
R38  137.81,11.54 0 top
R39  132.62,8.73 0 top
R40  132.62,11.73 0 top
R41  151.15,31.79 180 top
R42  151.15,34.78 180 top
R43  157.15,31.79 180 top
R44  157.15,34.78 180 top
R45  169.15,31.79 180 top
R46  169.15,34.78 180 top
R47  163.15,31.79 180 top
R48  163.15,34.78 180 top
R49  175.15,31.79 180 top
R50  175.15,34.78 180 top
R51  181.15,31.79 180 top
R52  181.15,34.78 180 top
R53  170.34,8.73 0 top
R54  170.34,11.73 0 top
R55  164.15,8.79 0 top
R56  164.15,11.79 0 top
R57  184.34,8.59 0 top
R58  184.34,11.59 0 top
R59  179.15,8.79 0 top
R60  179.15,11.79 0 top
R61  206,31.71 180 top
R62  206,34.72 180 top
R63  212,31.71 180 top
R64  212,34.72 180 top
R73  217.19,8.66 0 top
R74  217.19,11.66 0 top
R75  211,8.71 0 top
R76  211,11.71 0 top
X1  60.87,11.76 270 top
X2  80.86,17.75 90 top
X3  80.86,20.25 90 top
X4  107.61,11.73 270 top
X5  127.61,17.73 90 top
X6  127.61,20.23 90 top
X7  154.15,11.79 270 top
X8  174.15,17.79 90 top
X9  174.15,20.29 90 top
X10  201,11.71 270 top
X11  221,17.71 90 top
X12  221,20.21 90 top
X13  13.88,11.82 270 top
X14  33.88,17.82 90 top
X15  33.88,20.32 90 top
X17  16.25,97.25 180 top
X18  36.25,97.25 180 top
X19  55.75,97.25 180 top
X20  75.25,97.25 180 top
X21  95.25,97.25 180 top

### Tracks (layer width: path | path; a pad name or v marks a point on that pad's centre or on a via)
3V3_MCN1  (via drill 0.61)
  Top 0.254: v77.5,28.9 77.8,28.6 77.8,23.1 75.9,21.2 75.9,20.3 X3.8 | v90.9,29.2 90.9,34.2 91.4,34.7 91.4,35.3 91.1,35.6 91.1,40.4 v93.6,42.9 | v103.6,44.8 103.6,46 103.3,46.3 103.3,65.8 104.2,66.7 105,66.7 PAD7.1
  Bottom 0.254: v77.5,28.9 87.3,28.9 87.6,28.6 90.3,28.6 v90.9,29.2 | v93.6,42.9 93.9,43.2 101,43.2 102.6,44.8 v103.6,44.8
3V3_MCN2  (via drill 0.61)
  Top 0.254: v116.9,10 116.8,9.9 116.8,8.8 R35.1 | v123,10 123,8.7 R31.1 | v121.2,9.9 121.2,15.8 121.1,15.9 121.1,16.8 121.6,17.3 121.6,18.2 122.6,19.2 122.6,20.2 X6.8 122.6,20.3 122.6,21.1 123.5,22 123.5,29.8 123.6,29.9 123.6,30.1 125.4,31.9 125.4,38.4 131.1,44.1 131.1,67.2 v130.8,67.5
  Bottom 0.254: v116.9,10 117.3,9.6 121.2,9.6 | 121.2,9.6 122.6,9.6 v123,10 | 121.2,9.6 v121.2,9.9 | v130.8,67.5 PAD19.1
3V3_MCN3  (via drill 0.61)
  Top 0.254: v177.3,82.4 176.4,81.5 176.4,79.3 175.8,78.7 175.8,76.5 175.2,75.9 175.2,73.7 174.6,73.1 174.6,69.5 174.9,69.2 174.9,65.6 175.3,65.2 175.3,42.6 171.7,39 171.7,31.9 169.9,30.1 169.9,22.5 169.1,21.7 169.1,20.3 X9.8
  Bottom 0.254: v177.3,82.4 178.9,82.4 179,82.5 PAD31.1
3V3_RCTL  (via drill 0.61)
  Top 0.254: v201.3,22 201,22.3 201,61.9 201.6,62.5 v201.6,63.7 | v199.5,65.2 199.2,65.5 199.2,72.7 198.6,73.3 198.6,78.5 v197.7,79.4
  Bottom 0.254: v201.3,22 214.6,22 215.9,20.7 215.9,20.3 X12.8 | v201.6,63.7 200.1,65.2 v199.5,65.2 | v197.7,79.4 196.1,79.4 196,79.5 PAD41.1
5V_MCN1  (via drill 0.61)
  Top 0.254: v69.9,21.4 69.9,20.8 71.7,19 77.3,19 77.9,19.6 77.9,20.2 X3.7 | v96.6,26.3 96.6,49.1 100.3,52.8 100.3,65.2 99.9,65.6 99.9,70.1 v99.6,70.4
  Bottom 0.254: v69.9,21.4 70.8,22.3 70.8,22.4 71.4,23 72,23 72.3,22.7 81.5,22.7 82.6,23.8 94.1,23.8 v96.6,26.3 | v99.6,70.4 103.9,70.4 104,70.5 PAD8.1
5V_MCN2  (via drill 0.61)
  Top 0.254: v124.9,28.6 125.2,28.3 125.2,22.3 124.6,21.7 124.6,20.3 X6.7 | v132,29.5 132,30.7 131.9,30.8 131.9,34 132.3,34.4 132.3,35 132,35.3 132,40.1 133.2,41.3 133.2,41.9 132.9,42.2 132.9,67.7 134.5,69.3 134.6,69.3 135,69.7 PAD20.1
  Bottom 0.254: v124.9,28.6 131.1,28.6 v132,29.5
5V_MCN3  (via drill 0.61)
  Top 0.254: v170.8,29.6 171.1,29.3 171.1,22.6 171,22.5 171,22.2 171.1,22.1 171.1,20.3 X9.7 | v172.6,29.6 172.6,30.8 172.3,31.1 172.3,38.8 175.9,42.4 175.9,65.4 175.5,65.8 175.5,69.4 175.2,69.7 175.2,72.9 175.8,73.5 175.8,75.7 176.4,76.3 176.4,78.5 v177.3,79.4
  Bottom 0.254: v172.6,29.6 v170.8,29.6 | v177.3,79.4 178.9,79.4 179,79.5 PAD32.1
5V_RCTL  (via drill 0.61)
  Top 0.254: v201.9,23.2 201.6,23.5 201.6,61.7 202.2,62.3 202.2,63.1 202.5,63.4 v202.5,64.6 | v200.1,66.4 199.8,66.7 199.8,72.9 199.2,73.5 199.2,78.7 198.6,79.3 198.6,81.5 v197.7,82.4
  Bottom 0.254: v201.9,23.2 202.5,22.6 216,22.6 217.9,20.7 217.9,20.3 X12.7 | v202.5,64.6 200.7,66.4 v200.1,66.4 | v197.7,82.4 196.1,82.4 196,82.5 PAD42.1
12V  (via drill 0.61)  (2 unrouted)
  Top 0.254: v13.3,94 13.3,91.8 X17.1 | v33.3,94 33.3,91.8 X18.1 | v52.8,94 52.8,91.8 X19.1 | v72.3,94 72.3,91.8 X20.1 | v92.3,94 92.3,91.8 X21.1
  pour Bottom: 0,0 240,0 240,100 0,100
AIN2_RCTL
  Top 0.254: C32.1 211.1,37.7 211.1,34.8 R64.2 211.1,34.7 211.1,31.8 R63.2 211.1,31.6 211.1,30.9 211,30.8 211,30.2 213.2,28 213.2,21.9 214,21.1 214,20.3 X12.9
AIN6_MCN2  (via drill 0.61)
  Top 0.254: C16.1 133.8,37.7 133.8,34.8 R30.2 133.8,34.7 133.8,31.8 R29.2 133.8,31.7 v133.8,30.4 | v136.6,29.9 136.6,20.3 X6.1
  Bottom 0.254: v136.6,29.9 136.1,30.4 v133.8,30.4
AIN6_MCN3  (via drill 0.61)
  Top 0.254: C26.1 180.3,37.7 180.3,34.9 R52.2 180.3,34.7 R51.2 180.3,31.7 180.3,31.1 180.4,31 v180.4,30.5 | v183.1,30 183.1,20.3 X9.1
  Bottom 0.254: v183.1,30 182.6,30.5 v180.4,30.5
AIN7_MCN1  (via drill 0.61)
  Top 0.254: R7.2 91.9,8.6 91.9,11.5 R11.2 91.9,11.6 91.9,14.5 C13.1 91.8,14.5 91.7,14.6 91.8,14.7 v91.8,15.8 | v89.9,16.3 89.9,17.7 X2.1
  Bottom 0.254: v89.9,16.3 90.4,15.8 v91.8,15.8
AIN7_MCN2  (via drill 0.61)
  Top 0.254: R37.2 138.7,8.6 138.7,11.5 R38.2 138.7,11.6 138.7,14.5 C19.1 138.6,14.6 v138.6,15.8 | v136.6,16.2 136.6,17.7 X5.1
  Bottom 0.254: v136.6,16.2 137,15.8 v138.6,15.8
AIN7_MCN3  (via drill 0.61)
  Top 0.254: R57.2 185.2,11.5 R58.2 185.2,11.7 185.2,14.5 C29.1 185.1,14.5 185,14.6 185.1,14.7 v185.1,15.8 | v183.1,16.3 183.1,17.7 X8.1
  Bottom 0.254: v183.1,16.3 183.6,15.8 v185.1,15.8
AIN8_MCN1
  Top 0.254: R32.2 86.7,8.8 86.7,11.7 R33.2 86.7,11.8 86.7,14.7 C14.1 86.8,14.7 86.9,14.8 86.8,14.9 86.8,15.7 87.9,16.8 87.9,17.7 X2.2
AIN8_MCN2
  Top 0.254: R39.2 133.5,8.8 133.5,11.7 R40.2 133.5,11.8 133.5,14.7 C20.1 133.6,14.6 133.7,14.7 133.6,14.8 133.6,15.9 133.7,16 133.7,16.1 134.6,17 134.6,17.7 X5.2
AIN8_MCN3
  Top 0.254: R59.2 180,11.7 R60.2 180,11.9 180,14.7 C30.1 180.1,14.7 180.2,14.8 180.1,14.9 180.1,15.7 180.4,16 180.4,16.1 181.1,16.8 181.1,17.7 X8.2
CAN2_H  (via drill 0.61)
  Top 0.254: v73.6,87.9 72.4,87.9 72.3,87.8 72.3,87.2 X20.4 | v90.9,87.9 92.3,87.9 92.3,87.2 X21.4 92.3,87.1 v92.3,84.9 | PAD46.1 208,71.3 199.8,63.1 199.8,14.4 199,13.6 199,12.8 X10.5 | v202.6,85.7 202.6,79.2 203.2,78.6 v203.2,73.6
  Bottom 0.254: v90.9,87.9 v73.6,87.9 | v92.3,84.9 93.2,85.8 95.6,85.8 96,85.4 202.3,85.4 v202.6,85.7 | v203.2,73.6 206.9,73.6 207,73.5 PAD46.1
CAN2_L  (via drill 0.61)
  Top 0.254: v76.6,87 76.5,86.9 75.3,86.9 75.3,87.1 X20.5 | v93.9,87 95.3,87 95.3,87.1 X21.5 95.3,86.9 v95.3,84.9 | v198.9,14.7 199.2,15 199.2,63.3 205.3,69.4 v205.3,76.4 v205.3,82.9
  Bottom 0.254: v76.6,87 76.9,87.3 90.3,87.3 90.6,87 v93.9,87 | v198.9,14.7 199.4,14.7 200.9,13.2 200.9,12.8 X10.3 | v205.3,76.4 206.9,76.4 207,76.5 PAD44.1 | v95.3,84.9 95.4,84.8 203.4,84.8 v205.3,82.9
CANA_H  (via drill 0.61)
  Top 0.254: v14.6,87.9 13.4,87.9 13.3,87.8 13.3,87.2 X17.4 13.3,87.1 v13.3,14.7 | v31.9,87.9 33.3,87.9 33.3,87.2 X18.4 | v51.4,87.9 52.7,87.9 52.8,87.8 52.8,87.2 X19.4 | v204.4,80.8 204.4,76.1 204.7,75.8 204.7,70 v203.4,68.7 | v203.4,65.5 203.4,64.3 203.1,64 203.1,63.2 202.8,62.9 202.8,62.1 202.2,61.5 202.2,24.7 v202.5,24.4 | v150.1,23.9 149.8,23.6 149.8,14.3 150.1,14 v150.1,12.8
  Bottom 0.254: v14.6,87.9 v31.9,87.9 v51.4,87.9 | 13.3,14.5 13.1,14.5 12.1,13.5 12.1,13.4 12,13.3 12,12.8 11.9,12.8 X13.5 | 13.3,14.5 17,14.5 18.7,12.8 57.2,12.8 57.3,12.9 57.4,12.8 58.8,12.8 X1.5 58.9,12.8 59,12.8 59,13.3 60.2,14.5 63.9,14.5 65.6,12.8 103.3,12.8 | 103.3,12.8 105,14.5 110.6,14.5 112.3,12.8 v150.1,12.8 152.1,12.8 X7.5 | X4.5 105.6,12.7 103.3,12.7 103.3,12.8 | PAD45.1 206.1,82.5 v204.4,80.8 | v203.4,65.5 v203.4,68.7 | v202.5,24.4 202.2,24.1 194.2,24.1 193.7,23.6 183.7,23.6 183.4,23.3 167.5,23.3 166.9,23.9 v150.1,23.9 | 13.3,14.5 v13.3,14.7
CANA_L  (via drill 0.61)
  Top 0.254: v17.6,87 17.5,86.9 16.3,86.9 16.3,87.1 X17.5 16.3,86.8 16.3,84.8 13.9,82.4 13.9,15.3 14.2,15 14.2,14.3 13.9,14 13.9,12.9 X13.3 | v34.9,87 36.3,87 36.3,87.1 X18.5 | v54.4,87 54.5,87.1 55.7,87.1 X19.5 | v106.2,9.1 106.2,9.4 106.1,9.5 106.1,9.8 106.6,10.3 106.6,11.2 107.2,11.8 107.3,11.8 107.6,12.1 107.6,12.7 X4.3 | v203.5,79.5 203.8,79.2 203.8,75.9 204.1,75.6 204.1,70.6 v203.8,70.3 | v204.3,66.4 204.3,65.2 204,64.9 204,64.1 203.7,63.8 203.7,63 203.4,62.7 203.4,61.9 202.8,61.3 202.8,25.9 v203.1,25.6 | v154.1,24.8 154.1,12.8 X7.3
  Bottom 0.254: v17.6,87 17.9,87.3 31.3,87.3 31.6,87 v34.9,87 34.9,87.1 35.1,87.3 50.8,87.3 51.1,87 v54.4,87 | 63.3,9.7 63.9,10.3 63.9,11 64.1,11.2 64.1,11.9 63.9,12.1 63.9,13.5 63.6,13.8 62.1,13.8 61.7,13.4 61.7,13.3 61.2,12.8 60.9,12.8 X1.3 | 63.3,9.7 62.7,9.7 62.5,9.5 21.2,9.5 17.9,12.8 17.7,12.8 16.6,13.9 15.1,13.9 14,12.8 13.9,12.8 X13.3 | 106.2,9 63.9,9 63.3,9.6 63.3,9.7 | 106.2,9 147.8,9 151,12.2 151.3,12.2 151.7,11.8 152.7,11.8 153.7,12.8 154.1,12.8 X7.3 | 106.2,9 v106.2,9.1 | v203.5,79.5 PAD47.1 | v203.8,70.3 203.8,69.5 204.3,69 v204.3,66.4 | v203.1,25.6 202.8,25.3 202.2,25.3 201.6,24.7 193.9,24.7 193.7,24.5 192.5,24.5 192.2,24.2 183.5,24.2 183.2,23.9 167.7,23.9 167.1,24.5 154.4,24.5 v154.1,24.8
FLEX1  (via drill 0.61)
  Top 0.254: v170,33.1 R45.1 | v176.8,39.4 177.1,39.7 177.1,65.8 176.7,66.2 176.7,69.8 176.4,70.1 176.4,72.5 v177.3,73.4
  Bottom 0.254: v170,33.1 176.3,39.4 v176.8,39.4 | v177.3,73.4 178.9,73.4 179,73.5 PAD34.1
FLEX1_MCN3  (via drill 0.61)
  Top 0.254: C23.1 168.3,37.7 168.3,34.9 R46.2 168.3,34.7 R45.2 168.3,31.7 168.3,31.1 168.4,31 v168.4,30.5 | v171.7,30.5 171.7,22.6 173.1,21.2 173.1,20.3 X9.6
  Bottom 0.254: v171.7,30.5 v168.4,30.5
FLEX2  (via drill 0.61)
  Top 0.254: v164,33.1 R47.1 | v175.6,39.9 176.5,40.8 176.5,65.6 176.1,66 176.1,69.6 175.8,69.9 175.8,72.7 176.4,73.3 176.4,75.5 v177.3,76.4
  Bottom 0.254: v164,33.1 170.8,39.9 v175.6,39.9 | v177.3,76.4 178.9,76.4 179,76.5 PAD33.1
FLEX2_MCN3  (via drill 0.61)
  Top 0.254: C24.1 162.3,37.7 162.3,34.9 R48.2 162.3,34.7 R47.2 162.3,31.7 162.3,31.1 162.4,31 162.4,30.1 165.1,27.4 165.1,22.3 165,22.2 v165,22.1 | v174.5,21.8 175.1,21.2 175.1,20.3 X9.5
  Bottom 0.254: v174.5,21.8 174.2,22.1 v165,22.1
FLEX3  (via drill 0.61)
  Top 0.254: v176,33.1 R49.1 | v177.4,37.7 177.7,38 177.7,66 177.3,66.4 v177.3,70.4
  Bottom 0.254: v176,33.1 176,36.3 v177.4,37.7 | v177.3,70.4 178.9,70.4 179,70.5 PAD35.1
FLEX3_MCN3  (via drill 0.61)
  Top 0.254: C25.1 174.3,37.7 174.3,34.9 R50.2 174.3,34.7 R49.2 174.3,31.7 174.3,31.1 174.4,31 v174.4,30.5 | v180.3,29.2 180.3,22 181.1,21.2 181.1,20.3 X9.2
  Bottom 0.254: v180.3,29.2 179,30.5 v174.4,30.5
FLOW_MCTLLOOP_MCN2  (via drill 0.61)
  Top 0.254: R31.2 124.7,8.7 124.7,11.6 R34.2 124.7,11.8 124.7,14.6 C17.1 | X5.7 124.6,17.7 124.6,16.3 124.8,16.1 124.8,14.6 C17.1 | PAD14.1 150,69.8 148.3,68.1 148.3,66.9 148.4,66.8 148.4,65.4 149.4,64.4 149.4,40.7 147.7,39 147.7,32.6 143.1,28 v143.1,14.3 | v126,14.3 125.6,14.7 124.9,14.7 C17.1
  Bottom 0.254: v143.1,14.3 142.8,14 126.3,14 v126,14.3
FLOW_MTRLOOP_MCN2  (via drill 0.61)
  Top 0.254: R35.2 118.5,8.8 118.5,11.7 R36.2 118.5,11.8 118.5,14.7 C18.1 118.5,14.8 118.5,15.7 118.6,15.8 v118.6,16 | PAD13.1 150,40.5 148.3,38.8 148.3,28.9 149.2,28 v149.2,13.7
  Bottom 0.254: 121.3,16 122.6,17.3 122.6,17.7 X5.8 | v118.6,16 121.3,16 | v149.2,13.7 148.9,13.4 123.8,13.4 121.3,15.9 121.3,16
GND  (5 unrouted)
  pour Top (isolate 0.406): 0,0 240,0 240,100 0,100
GP0_MCN1
  Top 0.254: R20.2 77.9,8.8 R21.2 77.9,11.8 C7.1 77.8,14.6 77.7,14.7 77.8,14.8 77.8,16 77.9,16.1 77.9,17.7 X2.7
GP0_MCN3
  Top 0.254: R53.2 171.2,8.8 171.2,9.4 171.1,9.5 171.1,10.3 171.2,10.4 171.2,11.7 R54.2 171.2,11.8 171.2,14.7 C27.1 171.1,14.8 171.1,17.7 X8.7
GP1_MCN1  (via drill 0.61)
  Top 0.254: R22.2 71.7,8.8 71.7,11.7 R23.2 71.7,11.8 71.7,14.7 C8.1 71.8,14.8 72.6,14.8 v73,15.2
  Bottom 0.254: v73,15.2 73.8,15.2 75.5,16.9 75.5,17 75.8,17.3 75.8,17.7 X2.8
GP1_MCN3  (via drill 0.61)
  Top 0.254: R55.2 165,11.7 R56.2 165,11.9 165,14.7 C28.1 165.1,14.7 165.2,14.8 165.1,14.9 v165.1,16 | v168.6,16.4 169.1,16.9 169.1,17.7 X8.8
  Bottom 0.254: v168.6,16.4 168.2,16 v165.1,16
GP1_MCN4  (via drill 0.61)
  Top 0.254: R75.2 211.8,8.8 211.8,11.7 R76.2 211.8,11.8 211.8,14.7 C38.1 211.9,14.7 212.6,14.7 v213.2,15.3 | v215.5,16.3 215.7,16.5 215.7,16.6 216,16.9 X11.8
  Bottom 0.254: v215.5,16.3 214.5,15.3 v213.2,15.3
PRES_AMB  (via drill 0.61)
  Top 0.254: v82.6,33.1 82.7,33 82.7,31.8 R16.1 | v102.7,45.7 102.7,66 102.3,66.4 v102.3,79.4
  Bottom 0.254: v82.6,33.1 93.3,43.8 100.8,43.8 v102.7,45.7 | v102.3,79.4 103.9,79.4 104,79.5 PAD11.1
PRES_AMB_MCN1  (via drill 0.61)
  Top 0.254: C5.1 81,37.7 81,34.8 R17.2 81,34.7 81,31.8 R16.2 81,31.7 v81,30.4 | v87.9,29.5 87.9,20.3 X3.2
  Bottom 0.254: v87.9,29.5 81.9,29.5 v81,30.4
PRES_MTR_IN  (via drill 0.61)
  Top 0.254: v88.6,33.1 88.7,33 88.7,31.8 R18.1 | v90.5,35 90.5,44.8 89.8,45.5 v89.8,49 | v101.2,50.9 101.5,51.2 101.5,65.6 101.1,66 101.1,75.5 100.5,76.1 100.5,80.6 v102.3,82.4
  Bottom 0.254: v88.6,33.1 v90.5,35 | v89.8,49 90.2,49 91.5,50.3 100.6,50.3 v101.2,50.9 | v102.3,82.4 103.9,82.4 104,82.5 PAD12.1
PRES_MTR_IN_MCN1  (via drill 0.61)
  Top 0.254: C6.1 87,37.7 87,34.8 R19.2 87,34.7 87,31.8 R18.2 87,31.7 v87,30.4 | v89.8,29.9 89.8,26.1 89.9,26 89.9,20.3 X3.1
  Bottom 0.254: v89.8,29.9 89.3,30.4 v87,30.4
STEER_ANG  (via drill 0.61)
  Top 0.254: v76.6,33.1 76.7,33 76.7,31.8 R9.1 | v79.1,35.6 79.1,38.8 v82.3,42 | v101.8,49.7 102.1,50 102.1,65.8 101.7,66.2 101.7,76.1 v101.4,76.4
  Bottom 0.254: v76.6,33.1 v79.1,35.6 | v82.3,42 84,42 91.7,49.7 v101.8,49.7 | v101.4,76.4 103.9,76.4 104,76.5 PAD10.1
STEER_ANG_MCN1  (via drill 0.61)
  Top 0.254: C3.1 75,37.7 75,34.8 R10.2 75,34.7 75,31.8 R9.2 75,31.7 v75,30.4 | v78.4,30.4 78.4,22.6 79.9,21.1 79.9,20.3 X3.6
  Bottom 0.254: v78.4,30.4 v75,30.4
SUSP_FRNT  (via drill 0.61)
  Top 0.254: v60,31.3 59.5,31.8 58.8,31.8 R13.1 | v97.5,31.3 97.2,31.6 97.2,40.8 v97.5,41.1 | v113.1,41.1 113.5,41.1 115.1,42.7 115.1,43.5 115.7,44.1 115.7,61.7 114.9,62.5 114.9,66.5 114.3,67.1 114.3,78.2 v115.5,79.4
  Bottom 0.254: v60,31.3 66.3,31.3 66.6,31.6 93.9,31.6 94.2,31.3 v97.5,31.3 | v97.5,41.1 97.8,41.4 112.8,41.4 v113.1,41.1 | v115.5,79.4 118.9,79.4 119,79.5 PAD5.1
SUSP_FRNT_MCN1  (via drill 0.61)
  Top 0.254: C1.1 57,37.7 57,34.8 R14.2 57,34.7 57,31.8 R13.2 57,31.7 v57,30.4 | v68.8,29.5 68.8,23.7 71.9,20.6 71.9,20.3 X3.10
  Bottom 0.254: v68.8,29.5 68.5,29.8 63.6,29.8 63.3,29.5 57.9,29.5 v57,30.4
SUSP_REAR  (via drill 0.61)
  Top 0.254: v66,32.2 65.6,31.8 64.8,31.8 R1.1 | v94.5,32.2 94.8,32.5 94.8,40.8 v94.5,41.1 | v116.9,41.7 116.9,42.9 117.5,43.5 117.5,62.3 116.7,63.1 116.7,75.8 116.4,76.1 116.4,81.5 v117.3,82.4
  Bottom 0.254: v66,32.2 v94.5,32.2 | v94.5,41.1 94.8,41.4 95.4,41.4 96,42 116.6,42 v116.9,41.7 | v117.3,82.4 118.9,82.4 119,82.5 PAD6.1
SUSP_REAR_MCN1  (via drill 0.61)
  Top 0.254: C2.1 63,37.7 63,34.8 R8.2 63,34.7 63,31.8 R1.2 63,31.7 v63,30.4 | v72.4,30.4 72.4,22.6 73.9,21.1 73.9,20.3 X3.9
  Bottom 0.254: v63,30.4 v72.4,30.4
TEMP_AMB  (via drill 0.61)
  Top 0.254: v70.6,33.1 70.7,33 70.7,31.8 R12.1 | v88.9,45.7 v88.9,49.9 | v100,51.3 100.9,52.2 100.9,65.4 100.5,65.8 100.5,73.1 v100.2,73.4
  Bottom 0.254: v70.6,33.1 78.6,41.1 82.6,41.1 82.9,41.4 84.2,41.4 88.5,45.7 v88.9,45.7 | v88.9,49.9 90.3,49.9 91.3,50.9 99.6,50.9 v100,51.3 | v100.2,73.4 103.9,73.4 104,73.5 PAD9.1
TEMP_AMB_MCN1  (via drill 0.61)
  Top 0.254: C4.1 69,37.7 69,34.8 R15.2 69,34.7 69,31.8 R12.2 69,31.7 69,30.5 71.8,27.7 71.8,22.3 71.7,22.2 v71.7,22.1 | v81.9,21.9 81.9,20.3 X3.5
  Bottom 0.254: v81.9,21.9 81.7,22.1 v71.7,22.1
TEMP_CLNT_MCTL_IN  (via drill 0.61)
  Top 0.254: v123.7,33 123.5,32.8 123.5,31.8 R6.1 | v132.3,41.6 v132.3,76.4
  Bottom 0.254: v123.7,33 v132.3,41.6 | v132.3,76.4 133.9,76.4 134,76.5 PAD22.1
TEMP_CLNT_MCTL_IN_MCN2  (via drill 0.61)
  Top 0.254: C11.1 121.8,37.7 121.8,34.8 R24.2 121.8,34.7 121.8,31.8 R6.2 121.8,31.7 v121.8,30.4 | v125.1,30.4 125.8,29.7 125.8,21.9 126.6,21.1 126.6,20.3 X6.6
  Bottom 0.254: v125.1,30.4 v121.8,30.4
TEMP_CLNT_MCTL_OUT  (via drill 0.61)
  Top 0.254: v117.7,33 117.5,32.8 117.5,31.8 R25.1 | v119.3,34.6 v119.3,64.8
  Bottom 0.254: v117.7,33 v119.3,34.6 | v119.3,64.8 119.7,65.2 124.8,65.2 133,73.4 133.9,73.4 134,73.5 PAD21.1
TEMP_CLNT_MCTL_OUT_MCN2  (via drill 0.61)
  Top 0.254: C12.1 115.8,37.7 115.8,34.8 R26.2 115.8,34.7 115.8,31.8 R25.2 115.8,31.7 115.8,30.5 115.9,30.4 v115.9,29.5 | v126.7,29.5 126.4,29.2 126.4,23.4 127.8,22 127.8,21.9 128.6,21.1 128.6,20.3 X6.5
  Bottom 0.254: v115.9,29.5 v126.7,29.5
TEMP_CLNT_MTR_IN  (via drill 0.61)
  Top 0.254: v105.7,33 105.5,32.8 105.5,31.8 R2.1 | v118.4,39.9 118.7,40.2 118.7,63.1 v118.4,63.4 | v138.5,64.3 138.5,65.7 138.9,66.1 138.9,73.2 145.1,79.4 v145.5,79.4
  Bottom 0.254: v105.7,33 112.3,39.6 118.1,39.6 v118.4,39.9 | v118.4,63.4 120.8,63.4 121.4,64 125.2,64 125.8,64.6 137,64.6 137.3,64.3 v138.5,64.3 | v145.5,79.4 148.9,79.4 149,79.5 PAD17.1
TEMP_CLNT_MTR_IN_MCN2  (via drill 0.61)
  Top 0.254: C9.1 103.8,37.7 103.8,34.8 R3.2 103.8,34.7 103.8,31.8 R2.2 103.8,31.7 v103.8,30.4 | v116.8,28.6 116.8,22.8 118.6,21 118.6,20.3 X6.10
  Bottom 0.254: v116.8,28.6 115.6,28.6 114.4,29.8 110.4,29.8 110.1,29.5 104.7,29.5 v103.8,30.4
TEMP_CLNT_MTR_OUT  (via drill 0.61)
  Top 0.254: v111.7,33 111.5,32.8 111.5,31.8 R4.1 | v120.2,39 119.9,39.3 119.9,63.7 v120.5,64.3 | v137.6,65.2 137.6,65.6 138.3,66.3 138.3,73.4 v147.3,82.4
  Bottom 0.254: v111.7,33 117.7,39 v120.2,39 | v120.5,64.3 120.8,64.6 125,64.6 125.6,65.2 v137.6,65.2 | v147.3,82.4 148.9,82.4 149,82.5 PAD18.1
TEMP_CLNT_MTR_OUT_MCN2  (via drill 0.61)
  Top 0.254: C10.1 109.8,37.7 109.8,34.8 R5.2 109.8,34.7 109.8,31.8 R4.2 109.8,31.7 v109.8,30.4 | v119.1,30.4 119.8,29.7 119.8,21.9 120.6,21.1 120.6,20.3 X6.9
  Bottom 0.254: v119.1,30.4 v109.8,30.4
TEMP_CONTACTOR_BOX  (via drill 0.61)
  Top 0.254: v129.7,33 129.5,32.8 129.5,31.8 R27.1 | v131.4,34.7 131.4,41.9 131.7,42.2 131.7,75.8 131.4,76.1 131.4,78.5 v132.3,79.4
  Bottom 0.254: v129.7,33 v131.4,34.7 | v132.3,79.4 133.9,79.4 134,79.5 PAD23.1
TEMP_CONTACTOR_BOX_MCN2  (via drill 0.61)
  Top 0.254: C15.1 127.8,37.7 127.8,34.8 R28.2 127.8,34.7 127.8,31.8 R27.2 127.8,31.7 v127.8,30.4 | v131.1,30.4 131.1,24.5 134.6,21 134.6,20.3 X6.2
  Bottom 0.254: v131.1,30.4 v127.8,30.4
TEMP_TIRE_FRNT  (via drill 0.61)
  Top 0.254: v152,33.1 R41.1 | v163.7,40 164.4,40.7 164.4,64.4 163.4,65.4 163.4,66.8 163.3,66.9 163.3,68.1 164.5,69.3 164.6,69.3 165,69.7 PAD29.1
  Bottom 0.254: v152,33.1 158.9,40 v163.7,40
TEMP_TIRE_FRNT_MCN3  (via drill 0.61)
  Top 0.254: C21.1 150.3,37.7 150.3,34.9 R42.2 150.3,34.7 R41.2 150.3,31.7 150.3,31.1 150.4,31 v150.4,30.5 | v161.7,29.6 v161.7,22.5
  Bottom 0.254: v161.7,22.5 163.6,20.6 163.7,20.6 164,20.3 165.1,20.3 X9.10 | v161.7,29.6 161.4,29.9 157,29.9 156.7,29.6 151.3,29.6 v150.4,30.5
TEMP_TIRE_REAR  (via drill 0.61)
  Top 0.254: v158,33.1 R43.1 | v165,40.1 PAD30.1
  Bottom 0.254: v158,33.1 v165,40.1
TEMP_TIRE_REAR_MCN3  (via drill 0.61)
  Top 0.254: C22.1 156.3,37.7 156.3,34.9 R44.2 156.3,34.7 R43.2 156.3,31.7 156.3,31.1 156.4,31 v156.4,30.5 | v165.7,30.5 165.7,22.6 167.1,21.2 167.1,20.3 X9.9
  Bottom 0.254: v165.7,30.5 v156.4,30.5
THRTL_EN  (via drill 0.61)
  Top 0.254: v216.2,10 216.3,9.9 216.3,8.7 R73.1 | v198.3,15.9 198.6,16.2 198.6,31.5 196.8,33.3 196.8,34.5 197.4,35.1 197.4,67.4 195.5,69.3 195.4,69.3 195,69.7 PAD38.1
  Bottom 0.254: v216.2,10 210.9,15.3 201.3,15.3 200.7,15.9 v198.3,15.9
THRTL_EN_RCTL
  Top 0.254: R73.2 218,8.7 218,11.6 R74.2 218,11.7 218,14.6 C37.1 217.9,14.6 217.9,15.9 218,16 X11.7
THRTL_POS  (via drill 0.61)
  Top 0.254: v206.8,33 206.8,31.8 R61.1 | v198.3,33 198.6,33.3 198.6,72.5 v197.7,73.4
  Bottom 0.254: v198.3,33 v206.8,33 | v197.7,73.4 196.1,73.4 196,73.5 PAD39.1
THRTL_POS_RCTL  (via drill 0.61)
  Top 0.254: C31.1 205.1,37.7 205.1,34.8 R62.2 205.1,34.7 205.1,31.8 R61.2 205.1,31.6 v205.1,30.4 | v208.5,30.4 208.5,24.5 212,21 212,20.3 X12.10
  Bottom 0.254: v208.5,30.4 v205.1,30.4
UNUSED_A1  (via drill 0.61)
  Top 0.254: v90.1,9.9 90.2,9.8 90.2,8.6 R7.1 | v94.8,11 94.8,12.2 95.1,12.5 95.1,27.2 95.4,27.5 95.4,42 v95.1,42.3 | v117.8,42.6 118.1,42.9 118.1,62.5 117.3,63.3 v117.3,76.4
  Bottom 0.254: v90.1,9.9 91.2,11 v94.8,11 | v95.1,42.3 95.4,42.6 v117.8,42.6 | v117.3,76.4 118.9,76.4 119,76.5 PAD4.1
UNUSED_A2  (via drill 0.61)
  Top 0.254: v84.9,10.1 85,10 85,8.8 R32.1 | v95.7,11.9 95.7,26.6 96,26.9 96,49.3 99.7,53 99.7,64.6 v99.4,64.9
  Bottom 0.254: v84.9,10.1 87,12.2 95.4,12.2 v95.7,11.9 | v99.4,64.9 99.7,65.2 109.8,65.2 118,73.4 118.9,73.4 119,73.5 PAD3.1
UNUSED_A3  (via drill 0.61)
  Top 0.254: v135.7,33 135.5,32.8 135.5,31.8 R29.1 | v137.3,34.6 137.3,44.7 136.6,45.4 136.6,65.4 137.7,66.5 v137.7,82.4
  Bottom 0.254: v135.7,33 v137.3,34.6 | v137.7,82.4 136.1,82.4 136,82.5 PAD24.1
UNUSED_A4  (via drill 0.61)
  Top 0.254: v137.1,9.9 137.1,9.8 137,9.7 137,8.6 R37.1 | v141.3,11 141.3,12.2 141.6,12.5 141.6,14.8 141.9,15.1 141.9,28.4 143.1,29.6 143.1,62.8 146.7,66.4 146.7,72.8 146.4,73.1 146.4,75.5 v147.3,76.4
  Bottom 0.254: v137.1,9.9 138.2,11 v141.3,11 | v147.3,76.4 148.9,76.4 149,76.5 PAD16.1
UNUSED_A5  (via drill 0.61)
  Top 0.254: v131.9,10 131.8,9.9 131.8,8.8 R39.1 | v142.2,11.9 142.2,14.6 142.5,14.9 142.5,28.2 147.1,32.8 147.1,39.2 148.8,40.9 148.8,64.2 147.8,65.2 147.8,65.9 147.3,66.4 v147.3,73.4
  Bottom 0.254: v131.9,10 134.1,12.2 141.9,12.2 v142.2,11.9 | v147.3,73.4 148.9,73.4 149,73.5 PAD15.1
UNUSED_A6  (via drill 0.61)
  Top 0.254: v182,33.1 R51.1 | v178.3,36.8 178.3,63.6 180,65.3 PAD36.1
  Bottom 0.254: v182,33.1 v178.3,36.8
UNUSED_A7  (via drill 0.61)
  Top 0.254: v183.5,9.9 R57.1 | v187.1,13.5 187.1,19.6 v184,22.7 | v166.6,23 166.3,23.3 166.3,29.9 166.6,30.2 166.6,30.8 165.9,31.5 165.9,40.4 165.6,40.7 165.6,64.4 167.7,66.5 v167.7,73.4
  Bottom 0.254: v187.1,13.5 v183.5,9.9 | v184,22.7 166.9,22.7 v166.6,23 | v167.7,73.4 166.1,73.4 166,73.5 PAD28.1
UNUSED_A8  (via drill 0.61)
  Top 0.254: v178.3,10.1 R59.1 | v160.8,19.1 160.8,22.8 161.1,23.1 161.1,29 160.3,29.8 160.3,38.8 163.8,42.3 163.8,64.2 162.8,65.2 162.8,65.9 162.3,66.4 v162.3,76.4
  Bottom 0.254: v178.3,10.1 173.3,15.1 164.8,15.1 v160.8,19.1 | v162.3,76.4 163.9,76.4 164,76.5 PAD27.1
UNUSED_A9  (via drill 0.61)
  Top 0.254: v212.8,33 212.8,31.8 R63.1 | v197.7,34.2 198,34.5 198,71.9 196.8,73.1 196.8,74 195.5,75.3 195.4,75.3 195,75.7 PAD40.1
  Bottom 0.254: v212.8,33 211.9,33.9 206.5,33.9 206.2,33.6 198.9,33.6 198.3,34.2 v197.7,34.2
UNUSED_GP1  (via drill 0.61)
  Top 0.254: v76.2,7.4 76.2,8.7 R20.1 | v113.8,8.1 113.8,39.8 116.3,42.3 116.3,43.1 116.9,43.7 116.9,62.1 116.1,62.9 116.1,69.7 v115.8,70
  Bottom 0.254: v76.2,7.4 77.2,8.4 105.7,8.4 105.9,8.2 106.5,8.2 106.7,8.4 113.5,8.4 v113.8,8.1 | v115.8,70 116.2,70.4 118.9,70.4 119,70.5 PAD2.1
UNUSED_GP2  (via drill 0.61)
  Top 0.254: v69.9,10.1 70,10 70,8.8 R22.1 | v73.6,11.9 v73.6,13.7 | v112.9,15.1 113.2,15.4 113.2,40 115.7,42.5 115.7,43.3 116.3,43.9 116.3,61.9 115.5,62.7 115.5,67.1 v115.2,67.4
  Bottom 0.254: v69.9,10.1 71.7,11.9 v73.6,11.9 | v73.6,13.7 73.9,13.4 103.1,13.4 104.8,15.1 v112.9,15.1 | v115.2,67.4 118.9,67.4 119,67.5 PAD1.1
UNUSED_GP3  (via drill 0.61)
  Top 0.254: v169.2,10 169.5,9.7 169.5,8.8 R53.1 | v159.9,18.2 159.9,19.4 160.2,19.7 160.2,23 160.5,23.3 160.5,28.8 159.7,29.6 159.7,39 163.2,42.5 163.2,64 162.2,65 162.2,65.7 161.7,66.2 161.7,75.8 161.4,76.1 161.4,78.5 v162.3,79.4
  Bottom 0.254: v169.2,10 164.7,14.5 164.6,14.5 160.9,18.2 v159.9,18.2 | v162.3,79.4 163.9,79.4 164,79.5 PAD26.1
UNUSED_GP4  (via drill 0.61)
  Top 0.254: v163.3,10.1 R55.1 | v161.5,11.9 161.5,18.6 162.6,19.7 162.6,22.8 162.3,23.1 162.3,28.4 v162.6,28.7 | v166.8,31.8 166.5,32.1 166.5,40.6 166.2,40.9 166.2,64.2 168.3,66.3 168.3,72.8 168.6,73.1 168.6,81.5 v167.7,82.4
  Bottom 0.254: v163.3,10.1 v161.5,11.9 | v162.6,28.7 163.5,29.6 166,29.6 166.8,30.4 v166.8,31.8 | v167.7,82.4 166.1,82.4 166,82.5 PAD25.1
UNUSED_GP6  (via drill 0.61)
  Top 0.254: v209.9,10 210.1,9.8 210.1,8.8 R75.1 | v200.7,14.7 200.4,15 200.4,62.5 v200.7,62.8
  Bottom 0.254: v209.9,10 205.2,14.7 v200.7,14.7 | v200.7,62.8 197.5,66 196.6,66 195.8,66.8 195.8,67.5 PAD37.1